# EAGLE schematic BEP32_12nutzen_stencil (EAGLE 6.4), part 2 of 4
## Sheet 5 of 12
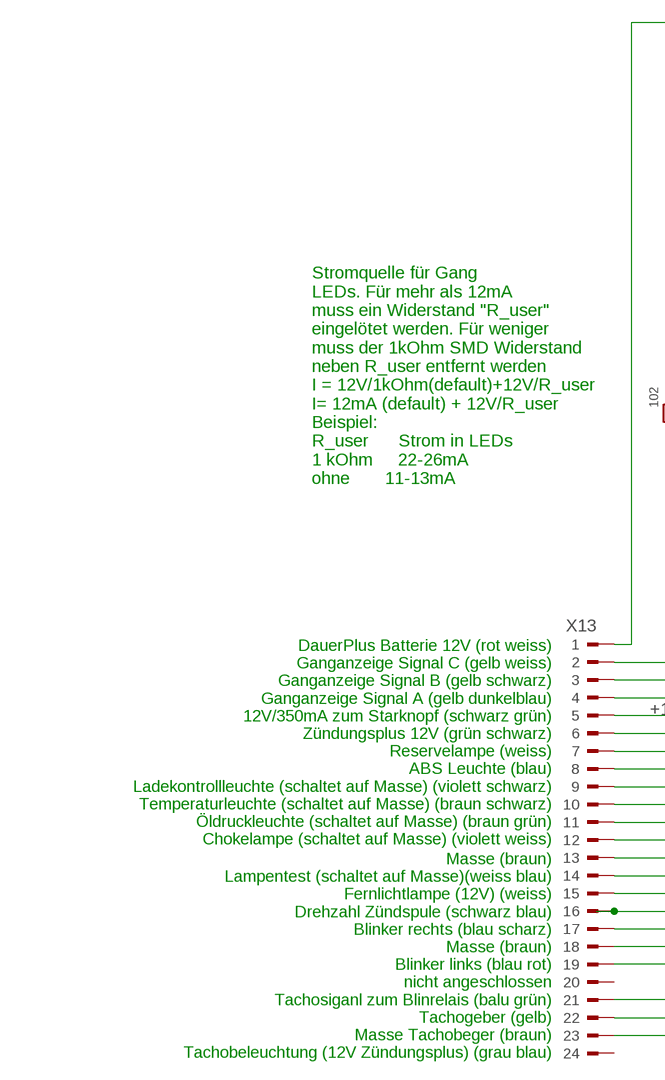
[diagram p8: schematic, sheet 5, part 1 of 2]
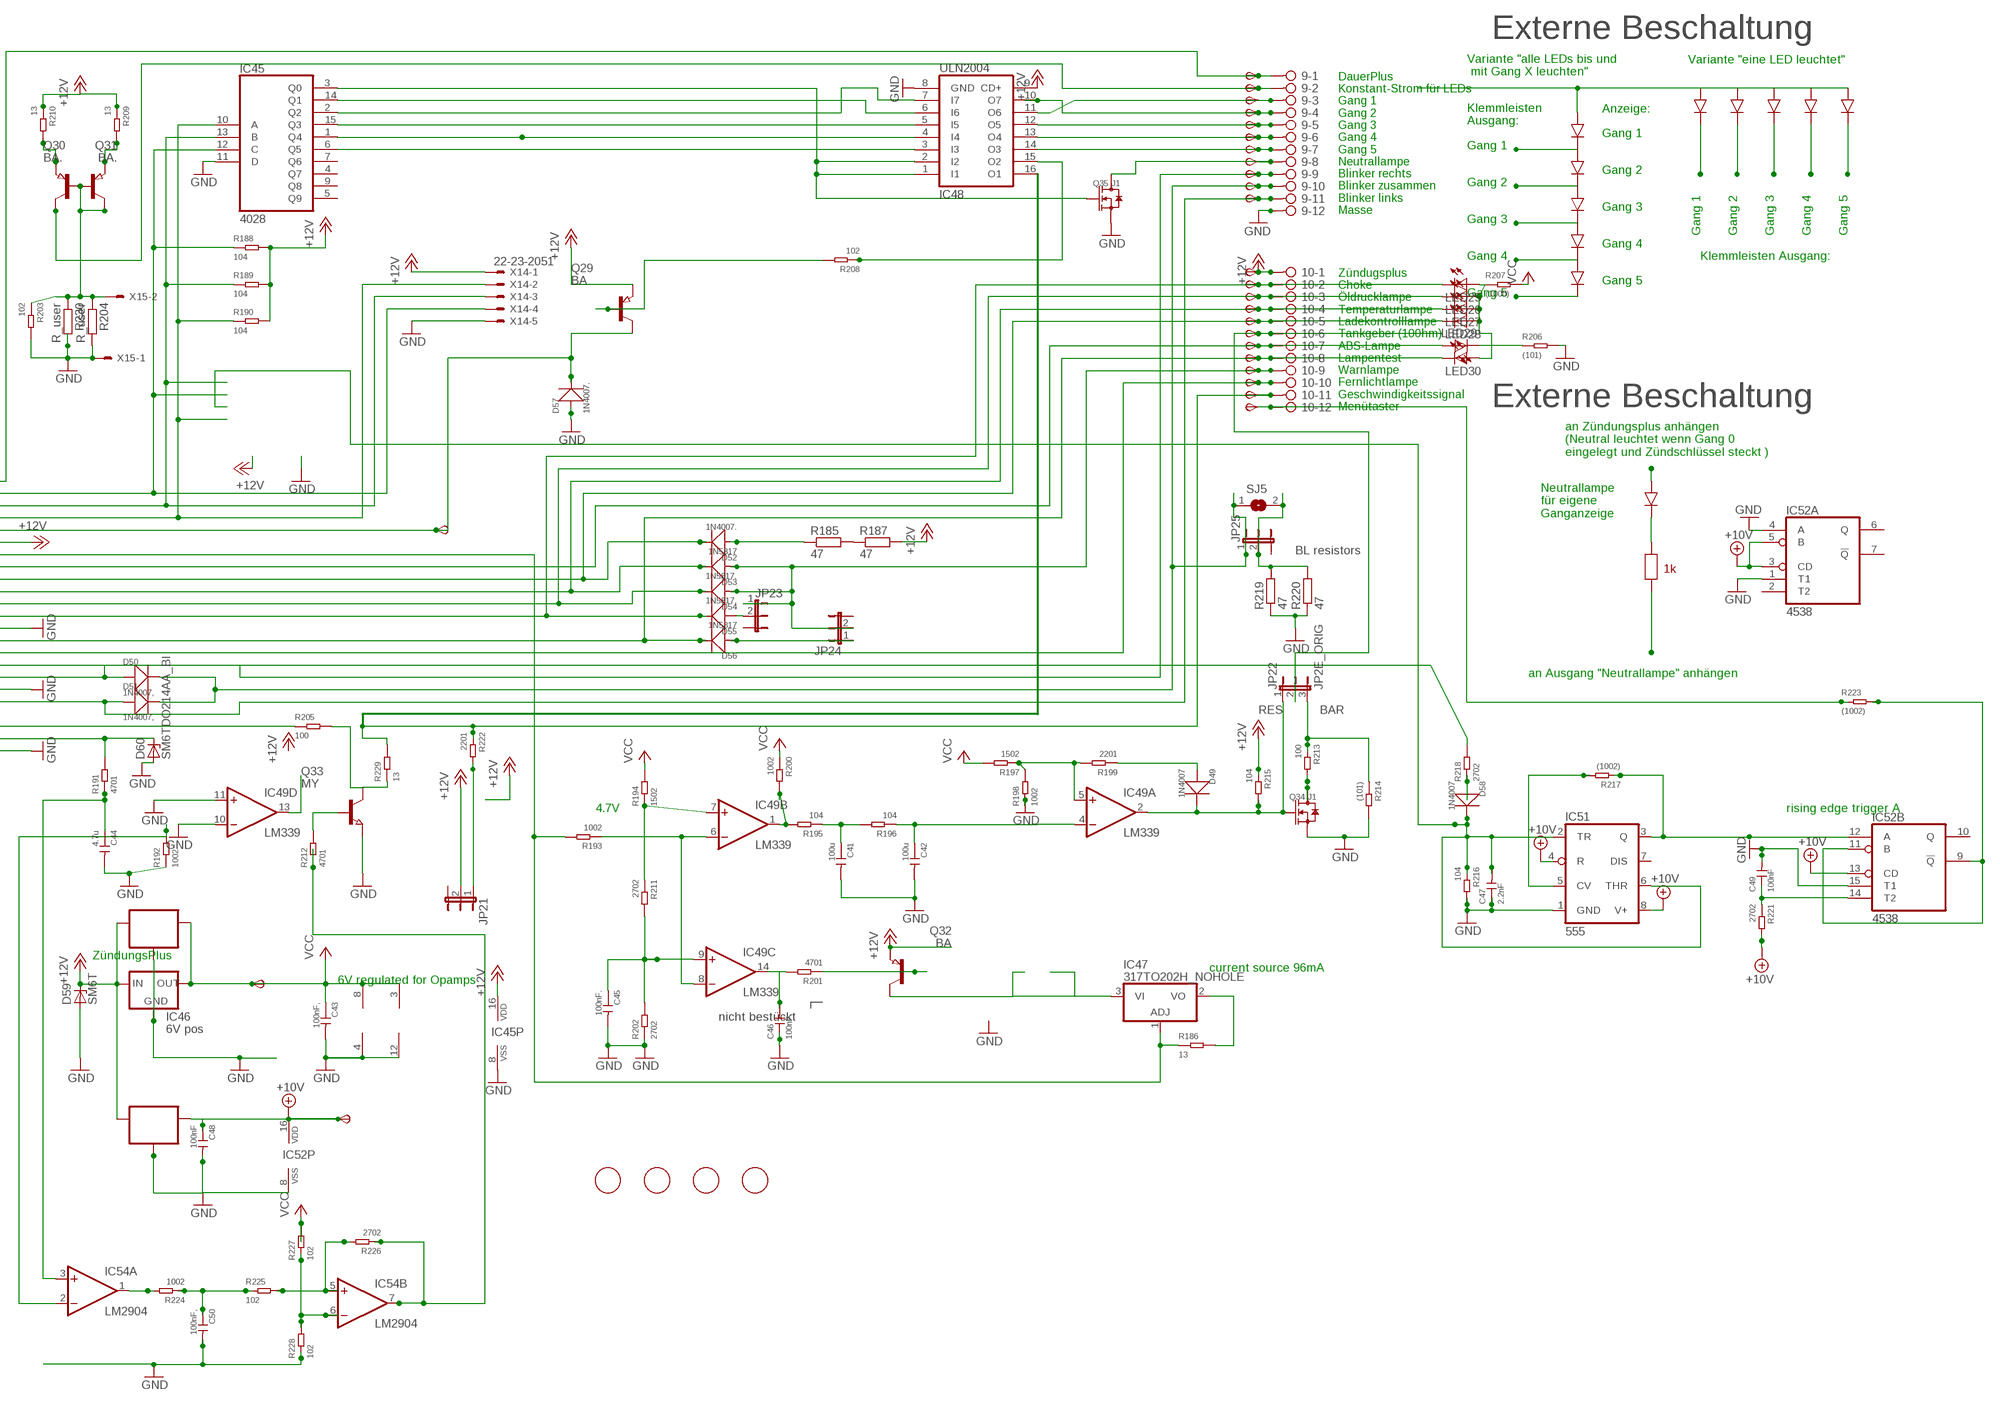
[diagram p9: schematic, sheet 5, part 2 of 2]

### Parts
6V4  TPSB2.0  [B2.0]
9  2081-1132  [12-PIN]
10  2081-1132  [12-PIN]
10V4  TPSB2.0  [B2.0]
C41  100u  CERAMIC-100UF-6.3V-20%-X5R(1206)  [C1206]
C42  100u  CERAMIC-100UF-6.3V-20%-X5R(1206)  [C1206]
C43  100nF,  CERAMIC-100NF-50V-10%-X7R(0805)  [C0805]
C44  4.7u  CERAMIC-4.7UF-25V-10%-X5R(0805)  [C0805]
C45  100nF.  CERAMIC-100NF-50V-10%-X7R(0805)  [C0805]
C46  100nF.  CERAMIC-100NF-50V-10%-X7R(0805)  [C0805]
C47  2.2nF  CERAMIC-100NF-50V-10%-X7R(0805)  [C0805]
C48  100nF  CERAMIC-100NF-50V-10%-X7R(0805)  [C0805]
C49  100nF  CERAMIC-100NF-50V-10%-X7R(0805)  [C0805]
C50  100nF,  CERAMIC-100NF-50V-10%-X7R(0805)  [C0805]
D49  1N4007  DIODE-GEN-PURPOSE-1KV-1A(DO-214AC)  [DO-214AC]
D50  1N4007,  DIODE-GEN-PURPOSE-1KV-1A(DO-214AC)  [DO-214AC]
D51  1N4007,  DIODE-GEN-PURPOSE-1KV-1A(DO-214AC)  [DO-214AC]
D52  1N4007.  DIODE-GEN-PURPOSE-1KV-1A(DO-214AC)  [DO-214AC]
D53  1N5817  DIODE-GEN-PURPOSE-1KV-1A(DO-214AC)DO-214AC/1206  [DO-214AC_SLIM]
D54  1N5817.  DIODE-GEN-PURPOSE-1KV-1A(DO-214AC)DO-214AC/1206  [DO-214AC_SLIM]
D55  1N5817.  DIODE-GEN-PURPOSE-1KV-1A(DO-214AC)DO-214AC/1206  [DO-214AC_SLIM]
D56  1N5817  DIODE-GEN-PURPOSE-1KV-1A(DO-214AC)DO-214AC/1206  [DO-214AC_SLIM]
D57  1N4007.  DIODE-GEN-PURPOSE-1KV-1A(DO-214AC)  [DO-214AC]
D58  1N4007  DIODE-GEN-PURPOSE-1KV-1A(DO-214AC)  [DO-214AC]
D59  SM6T  [DO214AA]
D60  SM6TDO214AA_BI  [DO214AA_BI]
FID17  FIDUCIAL  [FIDUCIAL_1MM]
FID18  FIDUCIAL  [FIDUCIAL_1MM]
FID19  FIDUCIAL  [FIDUCIAL_1MM]
FID20  FIDUCIAL  [FIDUCIAL_1MM]
IC45  4028  4028D  [SO16]
IC46  6V pos  78LXX  [78LXX]
IC47  317TO202H_NOHOLE  [TO220H_NOHOLE]
IC48  ULN2004  ULN2004AD  [SO16]
IC49  LM339  LM339D  [SO14]
IC50  78L06  78LXXSOT89_ROUND  [SOT89_ROUND]
IC51  555  NE555D  [SO08]
IC52  4538  4538D  [SO16]
IC53  78L10  78LXXSOT89_ROUND  [SOT89_ROUND]
IC54  LM2904  LM358D  [SO08]
JP21  JP2EJP2_SMALLPADS  [JP2_SMALLPADS]
JP22  JP2E_ORIG  [JP2_ORIG_SMALLPADS]
JP23  JP2EJP2_SMALLPADS  [JP2_SMALLPADS]
JP24  JP2EJP2_SMALLPADS  [JP2_SMALLPADS]
JP25  JP2EJP2_SMALLPADS  [JP2_SMALLPADS]
LED25  LEDLD260  [LD260]
LED26  LEDLD260  [LD260]
LED27  LEDLD260  [LD260]
LED28  LEDLD260  [LD260]
LED29  LEDLD260  [LD260]
LED30  LEDLD260  [LD260]
Q29  BA  PNP-TRANSISTOR_SOT89  [SOT89]
Q30  BA.  PNP-TRANSISTOR_SOT89  [SOT89]
Q31  BA.  PNP-TRANSISTOR_SOT89  [SOT89]
Q32  BA  PNP-TRANSISTOR_SOT89  [SOT89]
Q33  MY  NPN-TRANSISTOR_SOT89  [SOT89]
Q34  J1  SMD-MOSFET-N-CH-50V-200MA-BSS138W-7-F(SOT-23)  [SOT-23]
Q35  J1  SMD-MOSFET-N-CH-50V-200MA-BSS138W-7-F(SOT-23)  [SOT-23]
R185  47  R-EU_V235/17_1MM  [V235/17_1MM]
R186  13  SMD-RES-13R-5%-1/4W(1206)  [R1206]
R187  47  R-EU_V235/17_1MM  [V235/17_1MM]
R188  104  SMD-RES-10K-1%-1/8W(0805)  [R0805]
R189  104  SMD-RES-10K-1%-1/8W(0805)  [R0805]
R190  104  SMD-RES-10K-1%-1/8W(0805)  [R0805]
R191  4701  SMD-RES-4.7K-5%-1/8W(0805)  [R0805]
R192  1002  SMD-RES-10K-1%-1/8W(0805)  [R0805]
R193  1002  SMD-RES-10K-1%-1/8W(0805)  [R0805]
R194  1502  SMD-RES-10K-1%-1/8W(0805)  [R0805]
R195  104  SMD-RES-10K-1%-1/8W(0805)  [R0805]
R196  104  SMD-RES-10K-1%-1/8W(0805)  [R0805]
R197  1502  SMD-RES-10K-1%-1/8W(0805)  [R0805]
R198  1002  SMD-RES-10K-1%-1/8W(0805)  [R0805]
R199  2201  SMD-RES-2.2K-5%-1/8W(0805)  [R0805]
R200  1002  SMD-RES-10K-1%-1/8W(0805)  [R0805]
R201  4701  SMD-RES-4.7K-5%-1/8W(0805)  [R0805]
R202  2702  SMD-RES-4.7K-5%-1/8W(0805)  [R0805]
R203  102  SMD-RES-1K-5%-1/8W(0805)  [R0805]
R204  R_user  R-EU_R0805  [R0805]
R205  100  SMD-RES-220R-5%-1/8W(0805)  [R0805]
R206  (101)  SMD-RES-100R-5%-1/8W(0805)  [R0805]
R207  (1000)  SMD-RES-100R-5%-1/8W(0805)  [R0805]
R208  102  SMD-RES-1K-5%-1/8W(0805)  [R0805]
R209  13  SMD-RES-13R-5%-1/4W(1206)  [R1206]
R210  13  SMD-RES-13R-5%-1/4W(1206)  [R1206]
R211  2702  SMD-RES-4.7K-5%-1/8W(0805)  [R0805]
R212  4701  SMD-RES-4.7K-5%-1/8W(0805)  [R0805]
R213  100  SMD-RES-2.2K-5%-1/8W(0805)  [R0805]
R214  (101)  SMD-RES-2.2K-5%-1/8W(0805)  [R0805]
R215  104  SMD-RES-10K-1%-1/8W(0805)  [R0805]
R216  104  SMD-RES-10K-1%-1/8W(0805)  [R0805]
R217  (1002)  SMD-RES-10K-1%-1/8W(0805)  [R0805]
R218  2702  SMD-RES-10K-1%-1/8W(0805)  [R0805]
R219  47  R-EU_V235/17_1MM  [V235/17_1MM]
R220  47  R-EU_V235/17_1MM  [V235/17_1MM]
R221  2702  SMD-RES-4.7K-5%-1/8W(0805)  [R0805]
R222  2201  SMD-RES-2.2K-5%-1/8W(0805)  [R0805]
R223  (1002)  SMD-RES-4.7K-5%-1/8W(0805)  [R0805]
R224  1002  SMD-RES-10K-1%-1/8W(0805)  [R0805]
R225  102  SMD-RES-1K-5%-1/8W(0805)  [R0805]
R226  2702  SMD-RES-4.7K-5%-1/8W(0805)  [R0805]
R227  102  SMD-RES-1K-5%-1/8W(0805)  [R0805]
R228  102  SMD-RES-1K-5%-1/8W(0805)  [R0805]
R229  13  SMD-RES-13R-5%-1/4W(1206)  [R1206]
R230  R_user  R-EU_R0805  [R0805]
SJ5  SJ  [SJ]
START4  TPSB2.0  [B2.0]
TP93  TPSB2.0  [B2.0]
TP94  TPSB2.0  [B2.0]
TP95  TPSB2.0  [B2.0]
TP96  TPSB2.0  [B2.0]
TP97  TPSB2.0  [B2.0]
TP98  TPSB2.0  [B2.0]
TP99  TPSB2.0  [B2.0]
TP100  TPSB2.0  [B2.0]
TP101  TPSB2.0  [B2.0]
TP102  TPSB2.0  [B2.0]
TP103  TPSB2.0  [B2.0]
TP104  TPSB2.0  [B2.0]
TP105  TPSB2.0  [B2.0]
TP106  TPSB2.0  [B2.0]
TP107  TPSB2.0  [B2.0]
TP108  TPSB2.0  [B2.0]
TP109  TPSB2.0  [B2.0]
TP110  TPSB2.0  [B2.0]
TP111  TPSB1,27  [B1,27]
TP112  TPSB2.0  [B2.0]
TP113  TPSB2.0  [B2.0]
TP114  TPSB2.0  [B2.0]
TP115  TPSB2.0  [B2.0]
X13  CON_BMWV2  [24-PIN_V2]
X14  22-23-2051  [22-23-2051]
X15  22-23-2021  [22-23-2021]

### Nets
+10V: 10V4.TP(PP) C48.1 IC51.4(R) IC51.8(V+) IC52.3(A:CD) IC52.5(A:B) IC52.13(B:CD) IC52.16(P:VDD) IC53.1(OUT) R221.2 ; also sheet 1,2,3,4,6,7,8,9,10,11,12
+12V: 10.1 D59.C IC45.16(VDD) IC46.IN IC48.9(CD+) IC50.3(IN) IC53.3(IN) JP21.2 Q29.3(E) Q32.3(E) R187.2 R188.2 R189.2 R190.2 R209.1 R210.1 R215.1 TP114.TP(PP) X13.6 X14.1 ; also sheet 1,2,3,4,6,7,8,9,10,11,12
+12V5: IC54.7(B:OUT) R212.1 R226.1
GND: 9.12 C41.2 C42.2 C43.2 C44.2 C45.2 C46.1 C47.1 C48.2 C49.2 C50.2 D57.1(+) D59.A D60.A IC45.8(VSS) IC45.11(D) IC46.GND IC48.8(GND) IC49.10(D:-IN) IC49.11(D:+IN) IC49.12(P:GND) IC50.2(GND) IC50.2@1(GND) IC51.1(GND) IC52.1(A:T1) IC52.4(A:A) IC52.8(P:VSS) IC52.15(B:T1) IC53.2(GND) IC53.2@1(GND) IC54.4(P:V-) Q33.3(E) Q34.2(S) Q35.2(S) R192.1 R198.1 R202.1 R203.2 R204.2 R206.2 R214.2 R216.2 R219.1 R220.1 R228.1 R230.2 X13.13 X13.18 X13.23 X14.5 X15.1 ; also sheet 1,2,3,4,6,7,8,9,10,11,12
N$389: R185.2 R187.1
N$390: 10.9 D53.1(+) D54.1(+) JP23.1 JP24.2 TP111.TP(PP)
N$391: IC45.10(A) R190.1 X13.4 X14.2
N$392: IC45.13(B) R189.1 X13.3 X14.3
N$393: D57.2(-) Q29.2(C) START4.TP(PP) X13.5
N$394: IC45.12(C) R188.1 X13.2 X14.4
N$395: 10.7 LED29.A TP109.TP(PP) X13.8
N$396: 10.2 D55.2(-) LED25.K(C) TP104.TP(PP) X13.12
N$397: 10.3 D54.2(-) LED26.K(C) TP105.TP(PP) X13.11
N$398: 10.4 D53.2(-) LED27.K(C) TP106.TP(PP) X13.10
N$399: 10.8 D56.2(-) LED30.K(C) TP110.TP(PP) X13.14
N$400: 9.9 D50.1(+) TP101.TP(PP) X13.17
N$401: 9.11 D51.1(+) TP103.TP(PP) X13.19
N$402: D60.C R191.2 X13.22
N$403: C44.1 IC54.3(A:+IN) R191.1
N$404: 10.11 IC48.16(O1) R222.1 R229.2 TP113.TP(PP)
N$405: IC49.1(B:OUT) R195.2 R200.2
N$406: C41.1 R195.1 R196.2
N$407: C42.1 IC49.4(A:-IN) R196.1
N$408: IC49.5(A:+IN) R197.1 R198.2 R199.2
N$409: D49.1(+) R199.1
N$410: C45.1 IC49.9(C:+IN) R202.2 R211.2
N$411: C46.2 IC49.14(C:OUT) R201.2
N$412: Q32.1(B) R201.1
N$413: IC45.2(Q2) IC48.7(I7)
N$414: 9.5 IC48.12(O5) TP97.TP(PP)
N$415: IC45.1(Q4) IC48.4(I4)
N$416: 9.8 Q35.3(D) TP100.TP(PP)
N$417: 10.10 TP112.TP(PP) X13.15
N$418: 10.5 D52.2(-) LED28.K(C) TP107.TP(PP) X13.9
N$419: D52.1(+) R185.1
N$420: IC45.6(Q5) IC48.3(I3)
N$421: 9.4 IC48.10(O7) TP96.TP(PP)
N$422: IC47.1(ADJ) R186.1 R193.2 X13.7
N$423: IC49.6(B:-IN) IC49.8(C:-IN) R193.1
N$424: 9.2 Q31.2(C) TP94.TP(PP)
N$425: 9.1 TP93.TP(PP) X13.1
N$439: R218.2 X13.16
N$440: IC45.15(Q3) IC48.5(I5)
N$441: 9.6 IC48.13(O4) TP98.TP(PP)
N$442: 9.7 IC48.14(O3) TP99.TP(PP)
N$443: 10.6 JP22.2 TP108.TP(PP)
N$444: LED29.K(C) R206.1
N$445: LED25.A LED26.A LED27.A LED28.A LED30.A R207.1
N$446: Q29.1(B) R208.2
N$447: IC45.3(Q0) IC48.1(I1) IC48.2(I2) Q35.1(G)
N$448: IC45.14(Q1) IC48.6(I6)
N$449: 9.3 IC48.11(O6) TP95.TP(PP)
N$450: Q30.1(B) Q30.2(C) Q31.1(B) R203.1 R204.1 R230.1 X15.2
N$451: Q31.3(E) R210.2
N$452: Q30.3(E) R209.2
N$453: IC49.7(B:+IN) R194.1 R211.1
N$454: IC54.2(A:-IN) R192.2
N$455: Q33.1(B) R212.2
N$456: Q34.3(D) R213.2
N$457: IC47.2(VO) R186.2
N$458: IC47.3(VI) Q32.2(C)
N$459: C47.2 D58.2(-) IC51.2(TR) IC51.6(THR) R216.1
N$460: IC51.5(CV) R217.2
N$461: IC51.3(Q) IC52.12(B:A) R217.1
N$462: D58.1(+) R218.1
N$463: 9.10 D50.2(-) D51.2(-) JP25.1 SJ5.1 TP102.TP(PP)
N$464: JP25.2 R219.2 R220.2 SJ5.2
N$465: IC52.9(B:!Q) IC52.11(B:B) R223.2
N$466: C49.1 IC52.14(B:T2) R221.1
N$467: JP21.1 R222.2
N$468: IC48.15(O2) R208.1
N$469: 10.12 R223.1 TP115.TP(PP)
N$470: D55.1(+) JP23.2
N$471: D49.2(-) IC49.2(A:OUT) JP22.1 Q34.1(G) R215.2
N$472: IC54.1(A:OUT) R224.2
N$473: C50.1 R224.1 R225.1
N$474: IC54.5(B:+IN) R225.2 R226.2
N$475: IC54.6(B:-IN) R227.1 R228.2
N$476: D56.1(+) JP24.1
N$477: JP22.3 R213.1 R214.1
N$478: IC49.13(D:OUT)
N$479: R205.1 X13.21
N$480: Q33.2(C) R205.2 R229.1
VCC: 6V4.TP(PP) C43.1 IC46.OUT IC49.3(P:V+) IC50.1(OUT) IC54.8(P:V+) R194.2 R197.2 R200.1 R207.2 R227.2 ; also sheet 1,2,3,4,6,7,8,9,10,11,12
Unconnected: IC45.4(Q7) IC45.5(Q9) IC45.7(Q6) IC45.9(Q8) IC51.7(DIS) IC52.2(A:T2) IC52.6(A:Q) IC52.7(A:!Q) IC52.10(B:Q) X13.20 X13.24

### Notes on the sheet
- Externe Beschaltung
- Variante "eine LED leuchtet"
- Variante "alle LEDs bis und
   mit Gang X leuchten"
- Anzeige:
- Klemmleisten
  Ausgang:
- Gang 1
- DauerPlus
  Konstant-Strom für LEDs
  Gang 1
  Gang 2
  Gang 3
  Gang 4
  Gang 5
  Neutrallampe
  Blinker rechts
  Blinker zusammen
  Blinker links
  Masse
- Gang 1
- Gang 2
- Gang 2
- Gang 3
- Gang 3
- Gang 1 | Gang 2 | Gang 3 | Gang 4 | Gang 5
- Gang 4
- Gang 4 | Klemmleisten Ausgang:
- Gang 5
- Gang 5
- Zündugsplus
  Choke
  Öldrucklampe
  Temperaturlampe
  Ladekontrolllampe
  Tankgeber (100hm)
  ABS-Lampe
  Lampentest
  Warnlampe
  Fernlichtlampe
  Geschwindigkeitssignal
  Menütaster
- Stromquelle für Gang
  LEDs. Für mehr als 12mA
  muss ein Widerstand "R_user"
  eingelötet werden. Für weniger
  muss der 1kOhm SMD Widerstand
  neben R_user entfernt werden
  I = 12V/1kOhm(default)+12V/R_user
  I= 12mA (default) + 12V/R_user
  Beispiel:
  R_user      Strom in LEDs
  1 kOhm     22-26mA
  ohne       11-13mA
- Externe Beschaltung
- an Zündungsplus anhängen
  (Neutral leuchtet wenn Gang 0
  eingelegt und Zündschlüssel steckt )
- Neutrallampe
  für eigene
  Ganganzeige
- DauerPlus Batterie 12V (rot weiss)
  Ganganzeige Signal C (gelb weiss)
  Ganganzeige Signal B (gelb schwarz)
  Ganganzeige Signal A (gelb dunkelblau)
  12V/350mA zum Starknopf (schwarz grün)
  Zündungsplus 12V (grün schwarz)
  Reservelampe (weiss)
  ABS Leuchte (blau)
  Ladekontrollleuchte (schaltet auf Masse) (violett schwarz)
  Temperaturleuchte (schaltet auf Masse) (braun schwarz)
  Öldruckleuchte (schaltet auf Masse) (braun grün)
  Chokelampe (schaltet auf Masse) (violett weiss)
- BL resistors
- 1k
- an Ausgang "Neutrallampe" anhängen
- Masse (braun)
  Lampentest (schaltet auf Masse)(weiss blau)
  Fernlichtlampe (12V) (weiss)
  Drehzahl Zündspule (schwarz blau)
  Blinker rechts (blau scharz)
  Masse (braun)
  Blinker links (blau rot)
  nicht angeschlossen
  Tachosiganl zum Blinrelais (balu grün)
  Tachogeber (gelb)
  Masse Tachobeger (braun)
  Tachobeleuchtung (12V Zündungsplus) (grau blau)
- RES | BAR
- 4.7V | rising edge trigger A
- ZündungsPlus
- current source 96mA
- 6V regulated for Opamps
- nicht bestückt

## Sheet 6 of 12
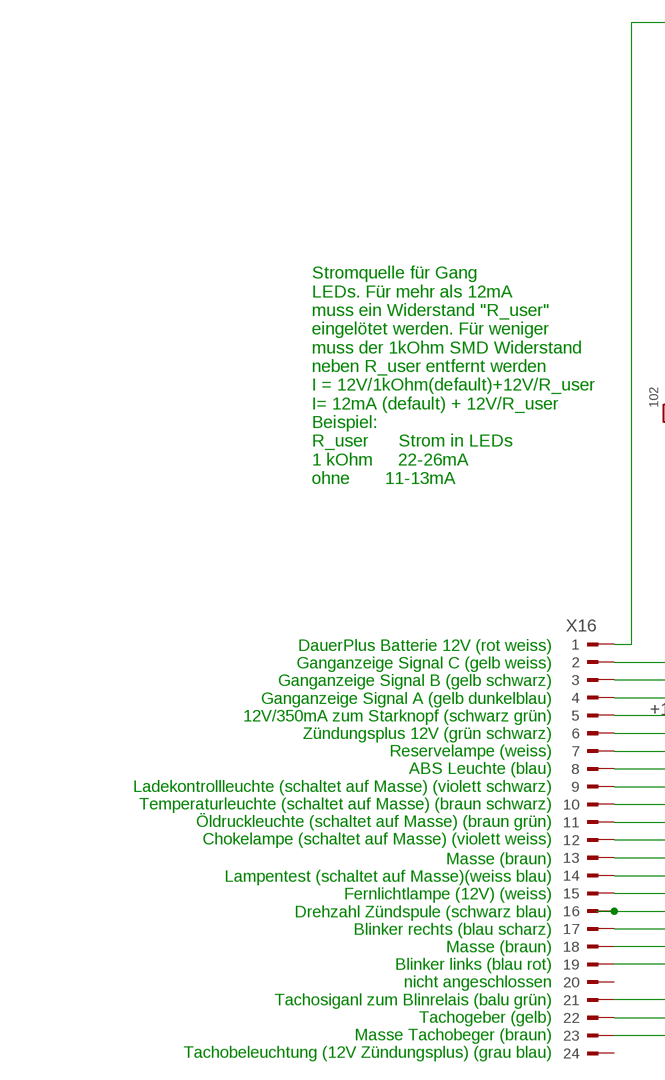
[diagram p10: schematic, sheet 6, part 1 of 2]
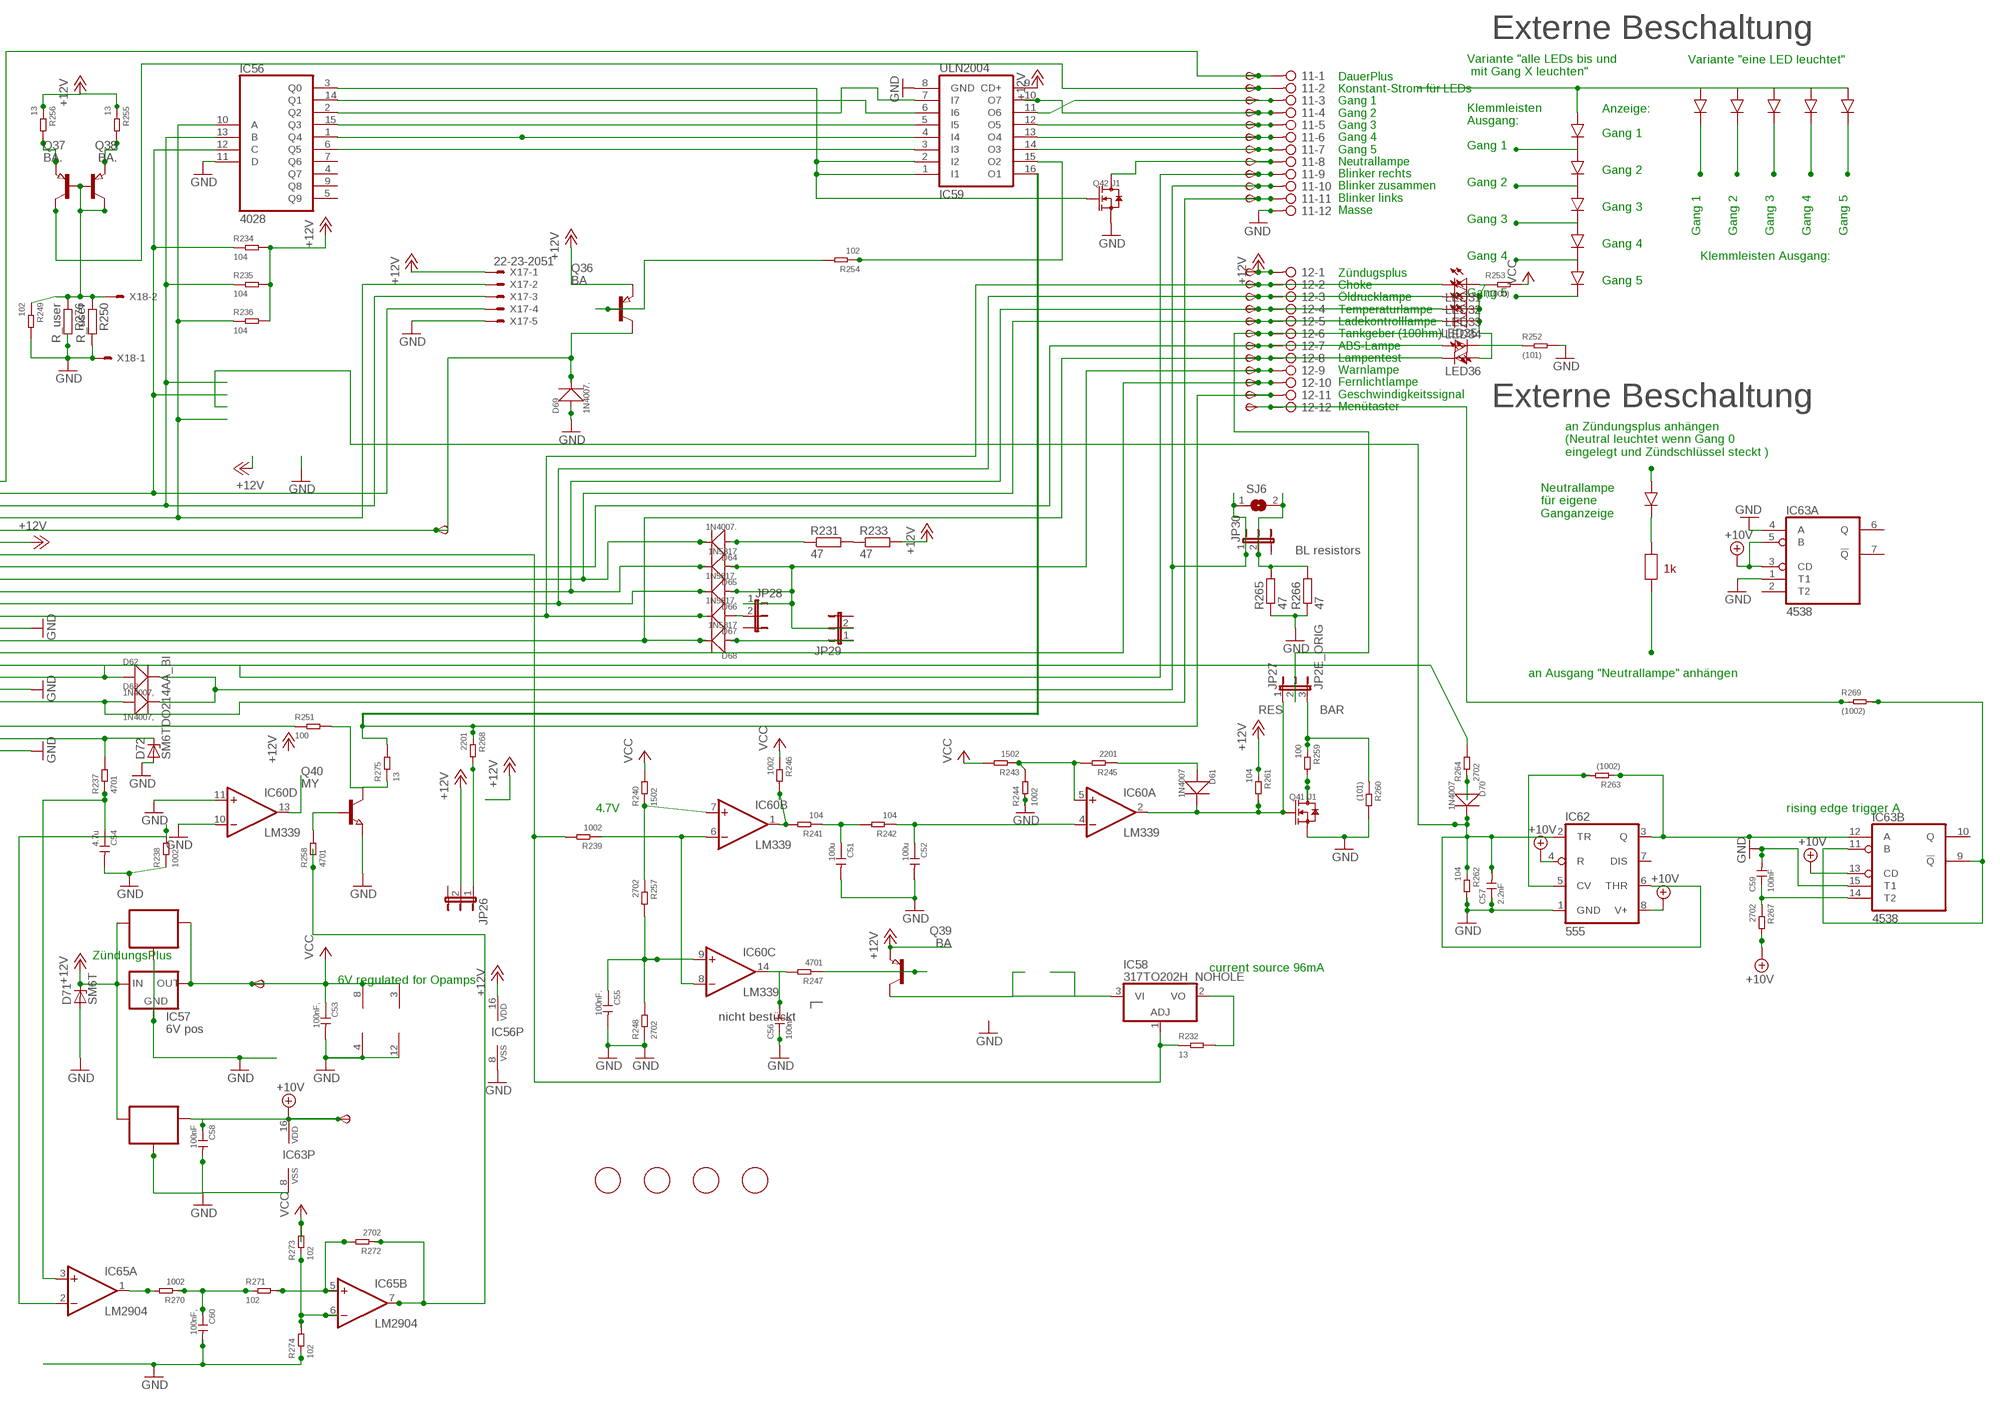
[diagram p11: schematic, sheet 6, part 2 of 2]

### Parts
6V5  TPSB2.0  [B2.0]
10V5  TPSB2.0  [B2.0]
11  2081-1132  [12-PIN]
12  2081-1132  [12-PIN]
C51  100u  CERAMIC-100UF-6.3V-20%-X5R(1206)  [C1206]
C52  100u  CERAMIC-100UF-6.3V-20%-X5R(1206)  [C1206]
C53  100nF,  CERAMIC-100NF-50V-10%-X7R(0805)  [C0805]
C54  4.7u  CERAMIC-4.7UF-25V-10%-X5R(0805)  [C0805]
C55  100nF.  CERAMIC-100NF-50V-10%-X7R(0805)  [C0805]
C56  100nF.  CERAMIC-100NF-50V-10%-X7R(0805)  [C0805]
C57  2.2nF  CERAMIC-100NF-50V-10%-X7R(0805)  [C0805]
C58  100nF  CERAMIC-100NF-50V-10%-X7R(0805)  [C0805]
C59  100nF  CERAMIC-100NF-50V-10%-X7R(0805)  [C0805]
C60  100nF,  CERAMIC-100NF-50V-10%-X7R(0805)  [C0805]
D61  1N4007  DIODE-GEN-PURPOSE-1KV-1A(DO-214AC)  [DO-214AC]
D62  1N4007,  DIODE-GEN-PURPOSE-1KV-1A(DO-214AC)  [DO-214AC]
D63  1N4007,  DIODE-GEN-PURPOSE-1KV-1A(DO-214AC)  [DO-214AC]
D64  1N4007.  DIODE-GEN-PURPOSE-1KV-1A(DO-214AC)  [DO-214AC]
D65  1N5817  DIODE-GEN-PURPOSE-1KV-1A(DO-214AC)DO-214AC/1206  [DO-214AC_SLIM]
D66  1N5817.  DIODE-GEN-PURPOSE-1KV-1A(DO-214AC)DO-214AC/1206  [DO-214AC_SLIM]
D67  1N5817.  DIODE-GEN-PURPOSE-1KV-1A(DO-214AC)DO-214AC/1206  [DO-214AC_SLIM]
D68  1N5817  DIODE-GEN-PURPOSE-1KV-1A(DO-214AC)DO-214AC/1206  [DO-214AC_SLIM]
D69  1N4007.  DIODE-GEN-PURPOSE-1KV-1A(DO-214AC)  [DO-214AC]
D70  1N4007  DIODE-GEN-PURPOSE-1KV-1A(DO-214AC)  [DO-214AC]
D71  SM6T  [DO214AA]
D72  SM6TDO214AA_BI  [DO214AA_BI]
FID21  FIDUCIAL  [FIDUCIAL_1MM]
FID22  FIDUCIAL  [FIDUCIAL_1MM]
FID23  FIDUCIAL  [FIDUCIAL_1MM]
FID24  FIDUCIAL  [FIDUCIAL_1MM]
IC56  4028  4028D  [SO16]
IC57  6V pos  78LXX  [78LXX]
IC58  317TO202H_NOHOLE  [TO220H_NOHOLE]
IC59  ULN2004  ULN2004AD  [SO16]
IC60  LM339  LM339D  [SO14]
IC61  78L06  78LXXSOT89_ROUND  [SOT89_ROUND]
IC62  555  NE555D  [SO08]
IC63  4538  4538D  [SO16]
IC64  78L10  78LXXSOT89_ROUND  [SOT89_ROUND]
IC65  LM2904  LM358D  [SO08]
JP26  JP2EJP2_SMALLPADS  [JP2_SMALLPADS]
JP27  JP2E_ORIG  [JP2_ORIG_SMALLPADS]
JP28  JP2EJP2_SMALLPADS  [JP2_SMALLPADS]
JP29  JP2EJP2_SMALLPADS  [JP2_SMALLPADS]
JP30  JP2EJP2_SMALLPADS  [JP2_SMALLPADS]
LED31  LEDLD260  [LD260]
LED32  LEDLD260  [LD260]
LED33  LEDLD260  [LD260]
LED34  LEDLD260  [LD260]
LED35  LEDLD260  [LD260]
LED36  LEDLD260  [LD260]
Q36  BA  PNP-TRANSISTOR_SOT89  [SOT89]
Q37  BA.  PNP-TRANSISTOR_SOT89  [SOT89]
Q38  BA.  PNP-TRANSISTOR_SOT89  [SOT89]
Q39  BA  PNP-TRANSISTOR_SOT89  [SOT89]
Q40  MY  NPN-TRANSISTOR_SOT89  [SOT89]
Q41  J1  SMD-MOSFET-N-CH-50V-200MA-BSS138W-7-F(SOT-23)  [SOT-23]
Q42  J1  SMD-MOSFET-N-CH-50V-200MA-BSS138W-7-F(SOT-23)  [SOT-23]
R231  47  R-EU_V235/17_1MM  [V235/17_1MM]
R232  13  SMD-RES-13R-5%-1/4W(1206)  [R1206]
R233  47  R-EU_V235/17_1MM  [V235/17_1MM]
R234  104  SMD-RES-10K-1%-1/8W(0805)  [R0805]
R235  104  SMD-RES-10K-1%-1/8W(0805)  [R0805]
R236  104  SMD-RES-10K-1%-1/8W(0805)  [R0805]
R237  4701  SMD-RES-4.7K-5%-1/8W(0805)  [R0805]
R238  1002  SMD-RES-10K-1%-1/8W(0805)  [R0805]
R239  1002  SMD-RES-10K-1%-1/8W(0805)  [R0805]
R240  1502  SMD-RES-10K-1%-1/8W(0805)  [R0805]
R241  104  SMD-RES-10K-1%-1/8W(0805)  [R0805]
R242  104  SMD-RES-10K-1%-1/8W(0805)  [R0805]
R243  1502  SMD-RES-10K-1%-1/8W(0805)  [R0805]
R244  1002  SMD-RES-10K-1%-1/8W(0805)  [R0805]
R245  2201  SMD-RES-2.2K-5%-1/8W(0805)  [R0805]
R246  1002  SMD-RES-10K-1%-1/8W(0805)  [R0805]
R247  4701  SMD-RES-4.7K-5%-1/8W(0805)  [R0805]
R248  2702  SMD-RES-4.7K-5%-1/8W(0805)  [R0805]
R249  102  SMD-RES-1K-5%-1/8W(0805)  [R0805]
R250  R_user  R-EU_R0805  [R0805]
R251  100  SMD-RES-220R-5%-1/8W(0805)  [R0805]
R252  (101)  SMD-RES-100R-5%-1/8W(0805)  [R0805]
R253  (1000)  SMD-RES-100R-5%-1/8W(0805)  [R0805]
R254  102  SMD-RES-1K-5%-1/8W(0805)  [R0805]
R255  13  SMD-RES-13R-5%-1/4W(1206)  [R1206]
R256  13  SMD-RES-13R-5%-1/4W(1206)  [R1206]
R257  2702  SMD-RES-4.7K-5%-1/8W(0805)  [R0805]
R258  4701  SMD-RES-4.7K-5%-1/8W(0805)  [R0805]
R259  100  SMD-RES-2.2K-5%-1/8W(0805)  [R0805]
R260  (101)  SMD-RES-2.2K-5%-1/8W(0805)  [R0805]
R261  104  SMD-RES-10K-1%-1/8W(0805)  [R0805]
R262  104  SMD-RES-10K-1%-1/8W(0805)  [R0805]
R263  (1002)  SMD-RES-10K-1%-1/8W(0805)  [R0805]
R264  2702  SMD-RES-10K-1%-1/8W(0805)  [R0805]
R265  47  R-EU_V235/17_1MM  [V235/17_1MM]
R266  47  R-EU_V235/17_1MM  [V235/17_1MM]
R267  2702  SMD-RES-4.7K-5%-1/8W(0805)  [R0805]
R268  2201  SMD-RES-2.2K-5%-1/8W(0805)  [R0805]
R269  (1002)  SMD-RES-4.7K-5%-1/8W(0805)  [R0805]
R270  1002  SMD-RES-10K-1%-1/8W(0805)  [R0805]
R271  102  SMD-RES-1K-5%-1/8W(0805)  [R0805]
R272  2702  SMD-RES-4.7K-5%-1/8W(0805)  [R0805]
R273  102  SMD-RES-1K-5%-1/8W(0805)  [R0805]
R274  102  SMD-RES-1K-5%-1/8W(0805)  [R0805]
R275  13  SMD-RES-13R-5%-1/4W(1206)  [R1206]
R276  R_user  R-EU_R0805  [R0805]
SJ6  SJ  [SJ]
START5  TPSB2.0  [B2.0]
TP116  TPSB2.0  [B2.0]
TP117  TPSB2.0  [B2.0]
TP118  TPSB2.0  [B2.0]
TP119  TPSB2.0  [B2.0]
TP120  TPSB2.0  [B2.0]
TP121  TPSB2.0  [B2.0]
TP122  TPSB2.0  [B2.0]
TP123  TPSB2.0  [B2.0]
TP124  TPSB2.0  [B2.0]
TP125  TPSB2.0  [B2.0]
TP126  TPSB2.0  [B2.0]
TP127  TPSB2.0  [B2.0]
TP128  TPSB2.0  [B2.0]
TP129  TPSB2.0  [B2.0]
TP130  TPSB2.0  [B2.0]
TP131  TPSB2.0  [B2.0]
TP132  TPSB2.0  [B2.0]
TP133  TPSB2.0  [B2.0]
TP134  TPSB1,27  [B1,27]
TP135  TPSB2.0  [B2.0]
TP136  TPSB2.0  [B2.0]
TP137  TPSB2.0  [B2.0]
TP138  TPSB2.0  [B2.0]
X16  CON_BMWV2  [24-PIN_V2]
X17  22-23-2051  [22-23-2051]
X18  22-23-2021  [22-23-2021]

### Nets
+10V: 10V5.TP(PP) C58.1 IC62.4(R) IC62.8(V+) IC63.3(A:CD) IC63.5(A:B) IC63.13(B:CD) IC63.16(P:VDD) IC64.1(OUT) R267.2 ; also sheet 1,2,3,4,5,7,8,9,10,11,12
+12V: 12.1 D71.C IC56.16(VDD) IC57.IN IC59.9(CD+) IC61.3(IN) IC64.3(IN) JP26.2 Q36.3(E) Q39.3(E) R233.2 R234.2 R235.2 R236.2 R255.1 R256.1 R261.1 TP137.TP(PP) X16.6 X17.1 ; also sheet 1,2,3,4,5,7,8,9,10,11,12
+12V6: IC65.7(B:OUT) R258.1 R272.1
GND: 11.12 C51.2 C52.2 C53.2 C54.2 C55.2 C56.1 C57.1 C58.2 C59.2 C60.2 D69.1(+) D71.A D72.A IC56.8(VSS) IC56.11(D) IC57.GND IC59.8(GND) IC60.10(D:-IN) IC60.11(D:+IN) IC60.12(P:GND) IC61.2(GND) IC61.2@1(GND) IC62.1(GND) IC63.1(A:T1) IC63.4(A:A) IC63.8(P:VSS) IC63.15(B:T1) IC64.2(GND) IC64.2@1(GND) IC65.4(P:V-) Q40.3(E) Q41.2(S) Q42.2(S) R238.1 R244.1 R248.1 R249.2 R250.2 R252.2 R260.2 R262.2 R265.1 R266.1 R274.1 R276.2 X16.13 X16.18 X16.23 X17.5 X18.1 ; also sheet 1,2,3,4,5,7,8,9,10,11,12
N$481: R231.2 R233.1
N$482: 12.9 D65.1(+) D66.1(+) JP28.1 JP29.2 TP134.TP(PP)
N$483: IC56.10(A) R236.1 X16.4 X17.2
N$484: IC56.13(B) R235.1 X16.3 X17.3
N$485: D69.2(-) Q36.2(C) START5.TP(PP) X16.5
N$486: IC56.12(C) R234.1 X16.2 X17.4
N$487: 12.7 LED35.A TP132.TP(PP) X16.8
N$488: 12.2 D67.2(-) LED31.K(C) TP127.TP(PP) X16.12
N$489: 12.3 D66.2(-) LED32.K(C) TP128.TP(PP) X16.11
N$490: 12.4 D65.2(-) LED33.K(C) TP129.TP(PP) X16.10
N$491: 12.8 D68.2(-) LED36.K(C) TP133.TP(PP) X16.14
N$492: 11.9 D62.1(+) TP124.TP(PP) X16.17
N$493: 11.11 D63.1(+) TP126.TP(PP) X16.19
N$494: D72.C R237.2 X16.22
N$495: C54.1 IC65.3(A:+IN) R237.1
N$496: 12.11 IC59.16(O1) R268.1 R275.2 TP136.TP(PP)
N$497: IC60.1(B:OUT) R241.2 R246.2
N$498: C51.1 R241.1 R242.2
N$499: C52.1 IC60.4(A:-IN) R242.1
N$500: IC60.5(A:+IN) R243.1 R244.2 R245.2
N$501: D61.1(+) R245.1
N$502: C55.1 IC60.9(C:+IN) R248.2 R257.2
N$503: C56.2 IC60.14(C:OUT) R247.2
N$504: Q39.1(B) R247.1
N$505: IC56.2(Q2) IC59.7(I7)
N$506: 11.5 IC59.12(O5) TP120.TP(PP)
N$507: IC56.1(Q4) IC59.4(I4)
N$508: 11.8 Q42.3(D) TP123.TP(PP)
N$509: 12.10 TP135.TP(PP) X16.15
N$510: 12.5 D64.2(-) LED34.K(C) TP130.TP(PP) X16.9
N$511: D64.1(+) R231.1
N$512: IC56.6(Q5) IC59.3(I3)
N$513: 11.4 IC59.10(O7) TP119.TP(PP)
N$514: IC58.1(ADJ) R232.1 R239.2 X16.7
N$515: IC60.6(B:-IN) IC60.8(C:-IN) R239.1
N$516: 11.2 Q38.2(C) TP117.TP(PP)
N$517: 11.1 TP116.TP(PP) X16.1
N$531: R264.2 X16.16
N$532: IC56.15(Q3) IC59.5(I5)
N$533: 11.6 IC59.13(O4) TP121.TP(PP)
N$534: 11.7 IC59.14(O3) TP122.TP(PP)
N$535: 12.6 JP27.2 TP131.TP(PP)
N$536: LED35.K(C) R252.1
N$537: LED31.A LED32.A LED33.A LED34.A LED36.A R253.1
N$538: Q36.1(B) R254.2
N$539: IC56.3(Q0) IC59.1(I1) IC59.2(I2) Q42.1(G)
N$540: IC56.14(Q1) IC59.6(I6)
N$541: 11.3 IC59.11(O6) TP118.TP(PP)
N$542: Q37.1(B) Q37.2(C) Q38.1(B) R249.1 R250.1 R276.1 X18.2
N$543: Q38.3(E) R256.2
N$544: Q37.3(E) R255.2
N$545: IC60.7(B:+IN) R240.1 R257.1
N$546: IC65.2(A:-IN) R238.2
N$547: Q40.1(B) R258.2
N$548: Q41.3(D) R259.2
N$549: IC58.2(VO) R232.2
N$550: IC58.3(VI) Q39.2(C)
N$551: C57.2 D70.2(-) IC62.2(TR) IC62.6(THR) R262.1
N$552: IC62.5(CV) R263.2
N$553: IC62.3(Q) IC63.12(B:A) R263.1
N$554: D70.1(+) R264.1
N$555: 11.10 D62.2(-) D63.2(-) JP30.1 SJ6.1 TP125.TP(PP)
N$556: JP30.2 R265.2 R266.2 SJ6.2
N$557: IC63.9(B:!Q) IC63.11(B:B) R269.2
N$558: C59.1 IC63.14(B:T2) R267.1
N$559: JP26.1 R268.2
N$560: IC59.15(O2) R254.1
N$561: 12.12 R269.1 TP138.TP(PP)
N$562: D67.1(+) JP28.2
N$563: D61.2(-) IC60.2(A:OUT) JP27.1 Q41.1(G) R261.2
N$564: IC65.1(A:OUT) R270.2
N$565: C60.1 R270.1 R271.1
N$566: IC65.5(B:+IN) R271.2 R272.2
N$567: IC65.6(B:-IN) R273.1 R274.2
N$568: D68.1(+) JP29.1
N$569: JP27.3 R259.1 R260.1
N$570: IC60.13(D:OUT)
N$571: R251.1 X16.21
N$572: Q40.2(C) R251.2 R275.1
VCC: 6V5.TP(PP) C53.1 IC57.OUT IC60.3(P:V+) IC61.1(OUT) IC65.8(P:V+) R240.2 R243.2 R246.1 R253.2 R273.2 ; also sheet 1,2,3,4,5,7,8,9,10,11,12
Unconnected: IC56.4(Q7) IC56.5(Q9) IC56.7(Q6) IC56.9(Q8) IC62.7(DIS) IC63.2(A:T2) IC63.6(A:Q) IC63.7(A:!Q) IC63.10(B:Q) X16.20 X16.24

### Notes on the sheet
- Externe Beschaltung
- Variante "eine LED leuchtet"
- Variante "alle LEDs bis und
   mit Gang X leuchten"
- Anzeige:
- Klemmleisten
  Ausgang:
- Gang 1
- DauerPlus
  Konstant-Strom für LEDs
  Gang 1
  Gang 2
  Gang 3
  Gang 4
  Gang 5
  Neutrallampe
  Blinker rechts
  Blinker zusammen
  Blinker links
  Masse
- Gang 1
- Gang 2
- Gang 2
- Gang 3
- Gang 3
- Gang 1 | Gang 2 | Gang 3 | Gang 4 | Gang 5
- Gang 4
- Gang 4 | Klemmleisten Ausgang:
- Gang 5
- Gang 5
- Zündugsplus
  Choke
  Öldrucklampe
  Temperaturlampe
  Ladekontrolllampe
  Tankgeber (100hm)
  ABS-Lampe
  Lampentest
  Warnlampe
  Fernlichtlampe
  Geschwindigkeitssignal
  Menütaster
- Stromquelle für Gang
  LEDs. Für mehr als 12mA
  muss ein Widerstand "R_user"
  eingelötet werden. Für weniger
  muss der 1kOhm SMD Widerstand
  neben R_user entfernt werden
  I = 12V/1kOhm(default)+12V/R_user
  I= 12mA (default) + 12V/R_user
  Beispiel:
  R_user      Strom in LEDs
  1 kOhm     22-26mA
  ohne       11-13mA
- Externe Beschaltung
- an Zündungsplus anhängen
  (Neutral leuchtet wenn Gang 0
  eingelegt und Zündschlüssel steckt )
- Neutrallampe
  für eigene
  Ganganzeige
- DauerPlus Batterie 12V (rot weiss)
  Ganganzeige Signal C (gelb weiss)
  Ganganzeige Signal B (gelb schwarz)
  Ganganzeige Signal A (gelb dunkelblau)
  12V/350mA zum Starknopf (schwarz grün)
  Zündungsplus 12V (grün schwarz)
  Reservelampe (weiss)
  ABS Leuchte (blau)
  Ladekontrollleuchte (schaltet auf Masse) (violett schwarz)
  Temperaturleuchte (schaltet auf Masse) (braun schwarz)
  Öldruckleuchte (schaltet auf Masse) (braun grün)
  Chokelampe (schaltet auf Masse) (violett weiss)
- BL resistors
- 1k
- an Ausgang "Neutrallampe" anhängen
- Masse (braun)
  Lampentest (schaltet auf Masse)(weiss blau)
  Fernlichtlampe (12V) (weiss)
  Drehzahl Zündspule (schwarz blau)
  Blinker rechts (blau scharz)
  Masse (braun)
  Blinker links (blau rot)
  nicht angeschlossen
  Tachosiganl zum Blinrelais (balu grün)
  Tachogeber (gelb)
  Masse Tachobeger (braun)
  Tachobeleuchtung (12V Zündungsplus) (grau blau)
- RES | BAR
- 4.7V | rising edge trigger A
- ZündungsPlus
- current source 96mA
- 6V regulated for Opamps
- nicht bestückt

## Sheet 7 of 12
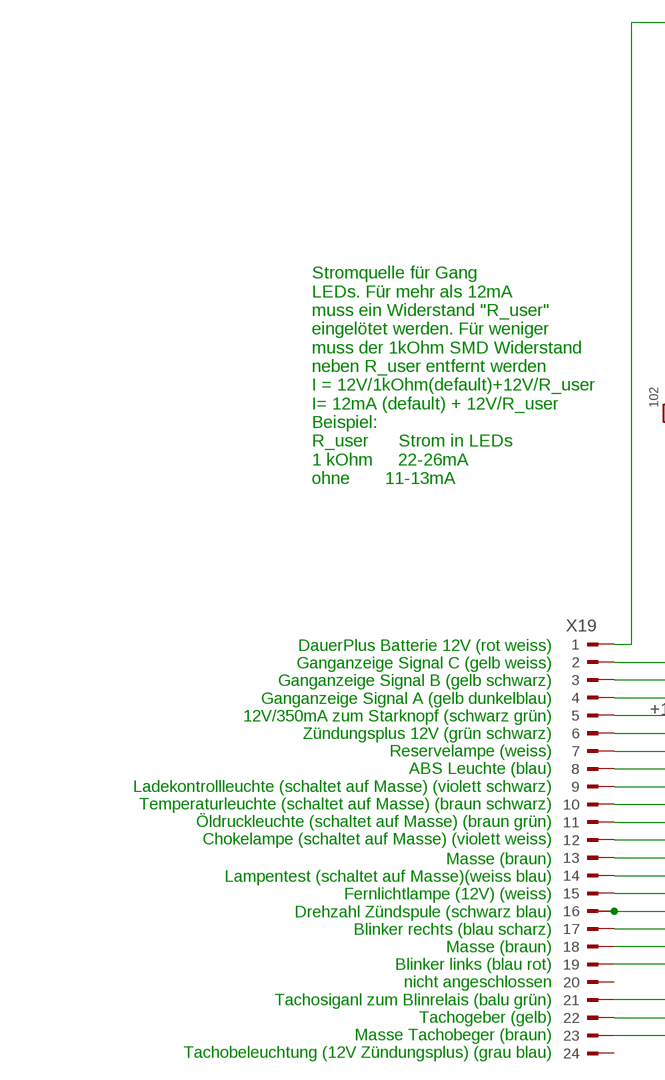
[diagram p12: schematic, sheet 7, part 1 of 2]
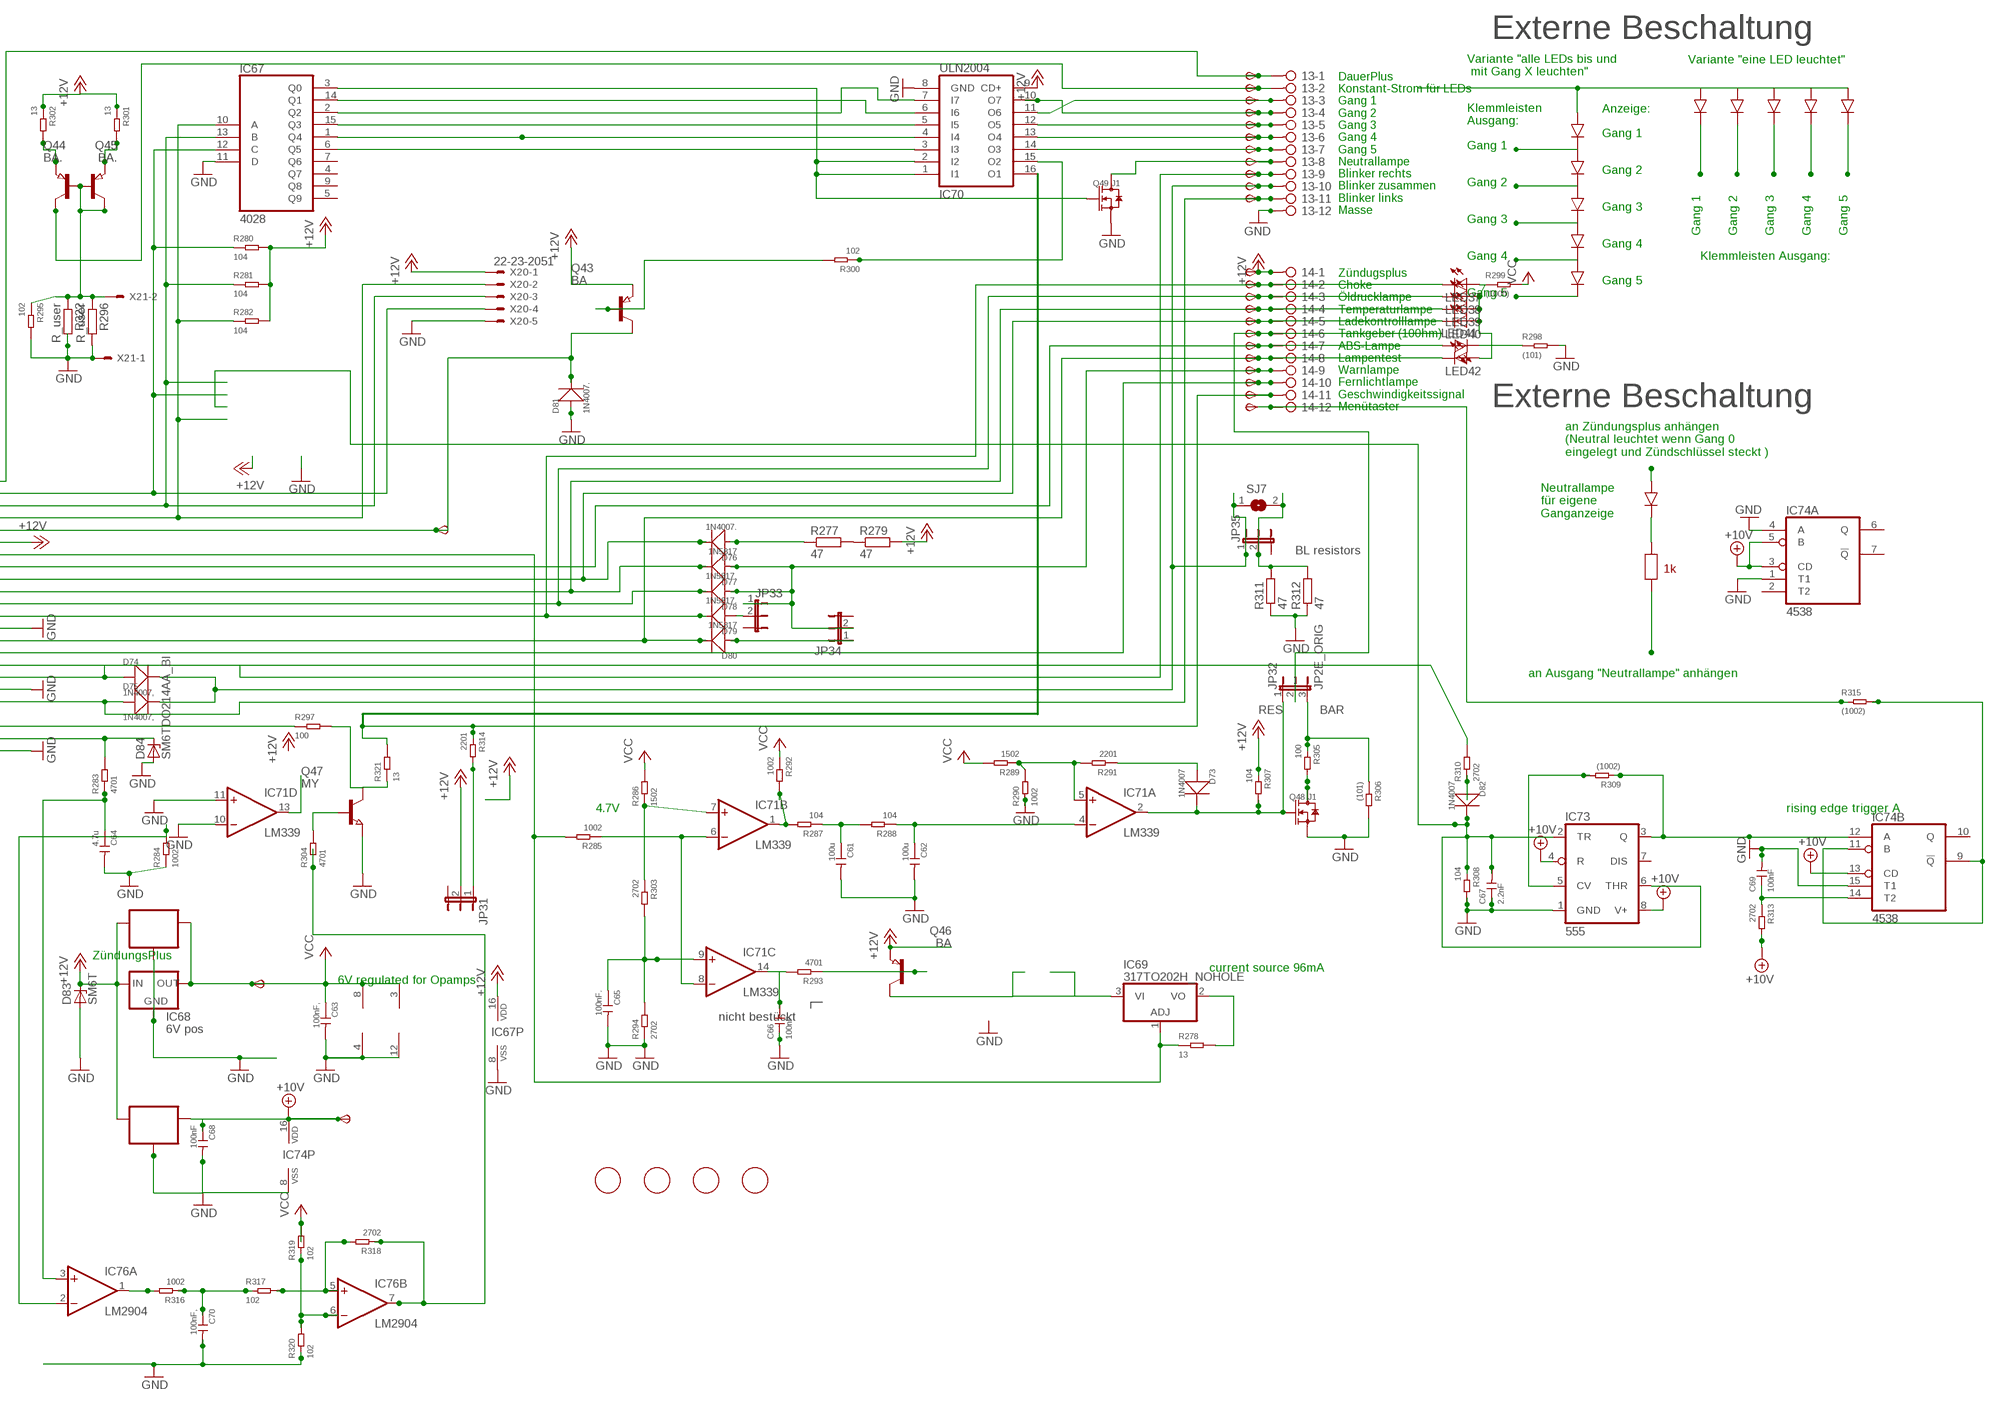
[diagram p13: schematic, sheet 7, part 2 of 2]

### Parts
6V6  TPSB2.0  [B2.0]
10V6  TPSB2.0  [B2.0]
13  2081-1132  [12-PIN]
14  2081-1132  [12-PIN]
C61  100u  CERAMIC-100UF-6.3V-20%-X5R(1206)  [C1206]
C62  100u  CERAMIC-100UF-6.3V-20%-X5R(1206)  [C1206]
C63  100nF,  CERAMIC-100NF-50V-10%-X7R(0805)  [C0805]
C64  4.7u  CERAMIC-4.7UF-25V-10%-X5R(0805)  [C0805]
C65  100nF.  CERAMIC-100NF-50V-10%-X7R(0805)  [C0805]
C66  100nF.  CERAMIC-100NF-50V-10%-X7R(0805)  [C0805]
C67  2.2nF  CERAMIC-100NF-50V-10%-X7R(0805)  [C0805]
C68  100nF  CERAMIC-100NF-50V-10%-X7R(0805)  [C0805]
C69  100nF  CERAMIC-100NF-50V-10%-X7R(0805)  [C0805]
C70  100nF,  CERAMIC-100NF-50V-10%-X7R(0805)  [C0805]
D73  1N4007  DIODE-GEN-PURPOSE-1KV-1A(DO-214AC)  [DO-214AC]
D74  1N4007,  DIODE-GEN-PURPOSE-1KV-1A(DO-214AC)  [DO-214AC]
D75  1N4007,  DIODE-GEN-PURPOSE-1KV-1A(DO-214AC)  [DO-214AC]
D76  1N4007.  DIODE-GEN-PURPOSE-1KV-1A(DO-214AC)  [DO-214AC]
D77  1N5817  DIODE-GEN-PURPOSE-1KV-1A(DO-214AC)DO-214AC/1206  [DO-214AC_SLIM]
D78  1N5817.  DIODE-GEN-PURPOSE-1KV-1A(DO-214AC)DO-214AC/1206  [DO-214AC_SLIM]
D79  1N5817.  DIODE-GEN-PURPOSE-1KV-1A(DO-214AC)DO-214AC/1206  [DO-214AC_SLIM]
D80  1N5817  DIODE-GEN-PURPOSE-1KV-1A(DO-214AC)DO-214AC/1206  [DO-214AC_SLIM]
D81  1N4007.  DIODE-GEN-PURPOSE-1KV-1A(DO-214AC)  [DO-214AC]
D82  1N4007  DIODE-GEN-PURPOSE-1KV-1A(DO-214AC)  [DO-214AC]
D83  SM6T  [DO214AA]
D84  SM6TDO214AA_BI  [DO214AA_BI]
FID25  FIDUCIAL  [FIDUCIAL_1MM]
FID26  FIDUCIAL  [FIDUCIAL_1MM]
FID27  FIDUCIAL  [FIDUCIAL_1MM]
FID28  FIDUCIAL  [FIDUCIAL_1MM]
IC67  4028  4028D  [SO16]
IC68  6V pos  78LXX  [78LXX]
IC69  317TO202H_NOHOLE  [TO220H_NOHOLE]
IC70  ULN2004  ULN2004AD  [SO16]
IC71  LM339  LM339D  [SO14]
IC72  78L06  78LXXSOT89_ROUND  [SOT89_ROUND]
IC73  555  NE555D  [SO08]
IC74  4538  4538D  [SO16]
IC75  78L10  78LXXSOT89_ROUND  [SOT89_ROUND]
IC76  LM2904  LM358D  [SO08]
JP31  JP2EJP2_SMALLPADS  [JP2_SMALLPADS]
JP32  JP2E_ORIG  [JP2_ORIG_SMALLPADS]
JP33  JP2EJP2_SMALLPADS  [JP2_SMALLPADS]
JP34  JP2EJP2_SMALLPADS  [JP2_SMALLPADS]
JP35  JP2EJP2_SMALLPADS  [JP2_SMALLPADS]
LED37  LEDLD260  [LD260]
LED38  LEDLD260  [LD260]
LED39  LEDLD260  [LD260]
LED40  LEDLD260  [LD260]
LED41  LEDLD260  [LD260]
LED42  LEDLD260  [LD260]
Q43  BA  PNP-TRANSISTOR_SOT89  [SOT89]
Q44  BA.  PNP-TRANSISTOR_SOT89  [SOT89]
Q45  BA.  PNP-TRANSISTOR_SOT89  [SOT89]
Q46  BA  PNP-TRANSISTOR_SOT89  [SOT89]
Q47  MY  NPN-TRANSISTOR_SOT89  [SOT89]
Q48  J1  SMD-MOSFET-N-CH-50V-200MA-BSS138W-7-F(SOT-23)  [SOT-23]
Q49  J1  SMD-MOSFET-N-CH-50V-200MA-BSS138W-7-F(SOT-23)  [SOT-23]
R277  47  R-EU_V235/17_1MM  [V235/17_1MM]
R278  13  SMD-RES-13R-5%-1/4W(1206)  [R1206]
R279  47  R-EU_V235/17_1MM  [V235/17_1MM]
R280  104  SMD-RES-10K-1%-1/8W(0805)  [R0805]
R281  104  SMD-RES-10K-1%-1/8W(0805)  [R0805]
R282  104  SMD-RES-10K-1%-1/8W(0805)  [R0805]
R283  4701  SMD-RES-4.7K-5%-1/8W(0805)  [R0805]
R284  1002  SMD-RES-10K-1%-1/8W(0805)  [R0805]
R285  1002  SMD-RES-10K-1%-1/8W(0805)  [R0805]
R286  1502  SMD-RES-10K-1%-1/8W(0805)  [R0805]
R287  104  SMD-RES-10K-1%-1/8W(0805)  [R0805]
R288  104  SMD-RES-10K-1%-1/8W(0805)  [R0805]
R289  1502  SMD-RES-10K-1%-1/8W(0805)  [R0805]
R290  1002  SMD-RES-10K-1%-1/8W(0805)  [R0805]
R291  2201  SMD-RES-2.2K-5%-1/8W(0805)  [R0805]
R292  1002  SMD-RES-10K-1%-1/8W(0805)  [R0805]
R293  4701  SMD-RES-4.7K-5%-1/8W(0805)  [R0805]
R294  2702  SMD-RES-4.7K-5%-1/8W(0805)  [R0805]
R295  102  SMD-RES-1K-5%-1/8W(0805)  [R0805]
R296  R_user  R-EU_R0805  [R0805]
R297  100  SMD-RES-220R-5%-1/8W(0805)  [R0805]
R298  (101)  SMD-RES-100R-5%-1/8W(0805)  [R0805]
R299  (1000)  SMD-RES-100R-5%-1/8W(0805)  [R0805]
R300  102  SMD-RES-1K-5%-1/8W(0805)  [R0805]
R301  13  SMD-RES-13R-5%-1/4W(1206)  [R1206]
R302  13  SMD-RES-13R-5%-1/4W(1206)  [R1206]
R303  2702  SMD-RES-4.7K-5%-1/8W(0805)  [R0805]
R304  4701  SMD-RES-4.7K-5%-1/8W(0805)  [R0805]
R305  100  SMD-RES-2.2K-5%-1/8W(0805)  [R0805]
R306  (101)  SMD-RES-2.2K-5%-1/8W(0805)  [R0805]
R307  104  SMD-RES-10K-1%-1/8W(0805)  [R0805]
R308  104  SMD-RES-10K-1%-1/8W(0805)  [R0805]
R309  (1002)  SMD-RES-10K-1%-1/8W(0805)  [R0805]
R310  2702  SMD-RES-10K-1%-1/8W(0805)  [R0805]
R311  47  R-EU_V235/17_1MM  [V235/17_1MM]
R312  47  R-EU_V235/17_1MM  [V235/17_1MM]
R313  2702  SMD-RES-4.7K-5%-1/8W(0805)  [R0805]
R314  2201  SMD-RES-2.2K-5%-1/8W(0805)  [R0805]
R315  (1002)  SMD-RES-4.7K-5%-1/8W(0805)  [R0805]
R316  1002  SMD-RES-10K-1%-1/8W(0805)  [R0805]
R317  102  SMD-RES-1K-5%-1/8W(0805)  [R0805]
R318  2702  SMD-RES-4.7K-5%-1/8W(0805)  [R0805]
R319  102  SMD-RES-1K-5%-1/8W(0805)  [R0805]
R320  102  SMD-RES-1K-5%-1/8W(0805)  [R0805]
R321  13  SMD-RES-13R-5%-1/4W(1206)  [R1206]
R322  R_user  R-EU_R0805  [R0805]
SJ7  SJ  [SJ]
START6  TPSB2.0  [B2.0]
TP139  TPSB2.0  [B2.0]
TP140  TPSB2.0  [B2.0]
TP141  TPSB2.0  [B2.0]
TP142  TPSB2.0  [B2.0]
TP143  TPSB2.0  [B2.0]
TP144  TPSB2.0  [B2.0]
TP145  TPSB2.0  [B2.0]
TP146  TPSB2.0  [B2.0]
TP147  TPSB2.0  [B2.0]
TP148  TPSB2.0  [B2.0]
TP149  TPSB2.0  [B2.0]
TP150  TPSB2.0  [B2.0]
TP151  TPSB2.0  [B2.0]
TP152  TPSB2.0  [B2.0]
TP153  TPSB2.0  [B2.0]
TP154  TPSB2.0  [B2.0]
TP155  TPSB2.0  [B2.0]
TP156  TPSB2.0  [B2.0]
TP157  TPSB1,27  [B1,27]
TP158  TPSB2.0  [B2.0]
TP159  TPSB2.0  [B2.0]
TP160  TPSB2.0  [B2.0]
TP161  TPSB2.0  [B2.0]
X19  CON_BMWV2  [24-PIN_V2]
X20  22-23-2051  [22-23-2051]
X21  22-23-2021  [22-23-2021]

### Nets
+10V: 10V6.TP(PP) C68.1 IC73.4(R) IC73.8(V+) IC74.3(A:CD) IC74.5(A:B) IC74.13(B:CD) IC74.16(P:VDD) IC75.1(OUT) R313.2 ; also sheet 1,2,3,4,5,6,8,9,10,11,12
+12V: 14.1 D83.C IC67.16(VDD) IC68.IN IC70.9(CD+) IC72.3(IN) IC75.3(IN) JP31.2 Q43.3(E) Q46.3(E) R279.2 R280.2 R281.2 R282.2 R301.1 R302.1 R307.1 TP160.TP(PP) X19.6 X20.1 ; also sheet 1,2,3,4,5,6,8,9,10,11,12
+12V7: IC76.7(B:OUT) R304.1 R318.1
GND: 13.12 C61.2 C62.2 C63.2 C64.2 C65.2 C66.1 C67.1 C68.2 C69.2 C70.2 D81.1(+) D83.A D84.A IC67.8(VSS) IC67.11(D) IC68.GND IC70.8(GND) IC71.10(D:-IN) IC71.11(D:+IN) IC71.12(P:GND) IC72.2(GND) IC72.2@1(GND) IC73.1(GND) IC74.1(A:T1) IC74.4(A:A) IC74.8(P:VSS) IC74.15(B:T1) IC75.2(GND) IC75.2@1(GND) IC76.4(P:V-) Q47.3(E) Q48.2(S) Q49.2(S) R284.1 R290.1 R294.1 R295.2 R296.2 R298.2 R306.2 R308.2 R311.1 R312.1 R320.1 R322.2 X19.13 X19.18 X19.23 X20.5 X21.1 ; also sheet 1,2,3,4,5,6,8,9,10,11,12
N$595: R277.2 R279.1
N$596: 14.9 D77.1(+) D78.1(+) JP33.1 JP34.2 TP157.TP(PP)
N$597: IC67.10(A) R282.1 X19.4 X20.2
N$598: IC67.13(B) R281.1 X19.3 X20.3
N$599: D81.2(-) Q43.2(C) START6.TP(PP) X19.5
N$600: IC67.12(C) R280.1 X19.2 X20.4
N$601: 14.7 LED41.A TP155.TP(PP) X19.8
N$602: 14.2 D79.2(-) LED37.K(C) TP150.TP(PP) X19.12
N$603: 14.3 D78.2(-) LED38.K(C) TP151.TP(PP) X19.11
N$604: 14.4 D77.2(-) LED39.K(C) TP152.TP(PP) X19.10
N$605: 14.8 D80.2(-) LED42.K(C) TP156.TP(PP) X19.14
N$606: 13.9 D74.1(+) TP147.TP(PP) X19.17
N$607: 13.11 D75.1(+) TP149.TP(PP) X19.19
N$608: D84.C R283.2 X19.22
N$609: C64.1 IC76.3(A:+IN) R283.1
N$610: 14.11 IC70.16(O1) R314.1 R321.2 TP159.TP(PP)
N$611: IC71.1(B:OUT) R287.2 R292.2
N$612: C61.1 R287.1 R288.2
N$613: C62.1 IC71.4(A:-IN) R288.1
N$614: IC71.5(A:+IN) R289.1 R290.2 R291.2
N$615: D73.1(+) R291.1
N$616: C65.1 IC71.9(C:+IN) R294.2 R303.2
N$617: C66.2 IC71.14(C:OUT) R293.2
N$618: Q46.1(B) R293.1
N$619: IC67.2(Q2) IC70.7(I7)
N$620: 13.5 IC70.12(O5) TP143.TP(PP)
N$621: IC67.1(Q4) IC70.4(I4)
N$622: 13.8 Q49.3(D) TP146.TP(PP)
N$623: 14.10 TP158.TP(PP) X19.15
N$624: 14.5 D76.2(-) LED40.K(C) TP153.TP(PP) X19.9
N$625: D76.1(+) R277.1
N$626: IC67.6(Q5) IC70.3(I3)
N$627: 13.4 IC70.10(O7) TP142.TP(PP)
N$628: IC69.1(ADJ) R278.1 R285.2 X19.7
N$629: IC71.6(B:-IN) IC71.8(C:-IN) R285.1
N$630: 13.2 Q45.2(C) TP140.TP(PP)
N$631: 13.1 TP139.TP(PP) X19.1
N$645: R310.2 X19.16
N$646: IC67.15(Q3) IC70.5(I5)
N$647: 13.6 IC70.13(O4) TP144.TP(PP)
N$648: 13.7 IC70.14(O3) TP145.TP(PP)
N$649: 14.6 JP32.2 TP154.TP(PP)
N$650: LED41.K(C) R298.1
N$651: LED37.A LED38.A LED39.A LED40.A LED42.A R299.1
N$652: Q43.1(B) R300.2
N$653: IC67.3(Q0) IC70.1(I1) IC70.2(I2) Q49.1(G)
N$654: IC67.14(Q1) IC70.6(I6)
N$655: 13.3 IC70.11(O6) TP141.TP(PP)
N$656: Q44.1(B) Q44.2(C) Q45.1(B) R295.1 R296.1 R322.1 X21.2
N$657: Q45.3(E) R302.2
N$658: Q44.3(E) R301.2
N$659: IC71.7(B:+IN) R286.1 R303.1
N$660: IC76.2(A:-IN) R284.2
N$661: Q47.1(B) R304.2
N$662: Q48.3(D) R305.2
N$663: IC69.2(VO) R278.2
N$664: IC69.3(VI) Q46.2(C)
N$665: C67.2 D82.2(-) IC73.2(TR) IC73.6(THR) R308.1
N$666: IC73.5(CV) R309.2
N$667: IC73.3(Q) IC74.12(B:A) R309.1
N$668: D82.1(+) R310.1
N$669: 13.10 D74.2(-) D75.2(-) JP35.1 SJ7.1 TP148.TP(PP)
N$670: JP35.2 R311.2 R312.2 SJ7.2
N$671: IC74.9(B:!Q) IC74.11(B:B) R315.2
N$672: C69.1 IC74.14(B:T2) R313.1
N$673: JP31.1 R314.2
N$674: IC70.15(O2) R300.1
N$675: 14.12 R315.1 TP161.TP(PP)
N$676: D79.1(+) JP33.2
N$677: D73.2(-) IC71.2(A:OUT) JP32.1 Q48.1(G) R307.2
N$678: IC76.1(A:OUT) R316.2
N$679: C70.1 R316.1 R317.1
N$680: IC76.5(B:+IN) R317.2 R318.2
N$681: IC76.6(B:-IN) R319.1 R320.2
N$682: D80.1(+) JP34.1
N$683: JP32.3 R305.1 R306.1
N$684: IC71.13(D:OUT)
N$685: R297.1 X19.21
N$686: Q47.2(C) R297.2 R321.1
VCC: 6V6.TP(PP) C63.1 IC68.OUT IC71.3(P:V+) IC72.1(OUT) IC76.8(P:V+) R286.2 R289.2 R292.1 R299.2 R319.2 ; also sheet 1,2,3,4,5,6,8,9,10,11,12
Unconnected: IC67.4(Q7) IC67.5(Q9) IC67.7(Q6) IC67.9(Q8) IC73.7(DIS) IC74.2(A:T2) IC74.6(A:Q) IC74.7(A:!Q) IC74.10(B:Q) X19.20 X19.24

### Notes on the sheet
- Externe Beschaltung
- Variante "eine LED leuchtet"
- Variante "alle LEDs bis und
   mit Gang X leuchten"
- Anzeige:
- Klemmleisten
  Ausgang:
- Gang 1
- DauerPlus
  Konstant-Strom für LEDs
  Gang 1
  Gang 2
  Gang 3
  Gang 4
  Gang 5
  Neutrallampe
  Blinker rechts
  Blinker zusammen
  Blinker links
  Masse
- Gang 1
- Gang 2
- Gang 2
- Gang 3
- Gang 3
- Gang 1 | Gang 2 | Gang 3 | Gang 4 | Gang 5
- Gang 4
- Gang 4 | Klemmleisten Ausgang:
- Gang 5
- Gang 5
- Zündugsplus
  Choke
  Öldrucklampe
  Temperaturlampe
  Ladekontrolllampe
  Tankgeber (100hm)
  ABS-Lampe
  Lampentest
  Warnlampe
  Fernlichtlampe
  Geschwindigkeitssignal
  Menütaster
- Stromquelle für Gang
  LEDs. Für mehr als 12mA
  muss ein Widerstand "R_user"
  eingelötet werden. Für weniger
  muss der 1kOhm SMD Widerstand
  neben R_user entfernt werden
  I = 12V/1kOhm(default)+12V/R_user
  I= 12mA (default) + 12V/R_user
  Beispiel:
  R_user      Strom in LEDs
  1 kOhm     22-26mA
  ohne       11-13mA
- Externe Beschaltung
- an Zündungsplus anhängen
  (Neutral leuchtet wenn Gang 0
  eingelegt und Zündschlüssel steckt )
- Neutrallampe
  für eigene
  Ganganzeige
- DauerPlus Batterie 12V (rot weiss)
  Ganganzeige Signal C (gelb weiss)
  Ganganzeige Signal B (gelb schwarz)
  Ganganzeige Signal A (gelb dunkelblau)
  12V/350mA zum Starknopf (schwarz grün)
  Zündungsplus 12V (grün schwarz)
  Reservelampe (weiss)
  ABS Leuchte (blau)
  Ladekontrollleuchte (schaltet auf Masse) (violett schwarz)
  Temperaturleuchte (schaltet auf Masse) (braun schwarz)
  Öldruckleuchte (schaltet auf Masse) (braun grün)
  Chokelampe (schaltet auf Masse) (violett weiss)
- BL resistors
- 1k
- an Ausgang "Neutrallampe" anhängen
- Masse (braun)
  Lampentest (schaltet auf Masse)(weiss blau)
  Fernlichtlampe (12V) (weiss)
  Drehzahl Zündspule (schwarz blau)
  Blinker rechts (blau scharz)
  Masse (braun)
  Blinker links (blau rot)
  nicht angeschlossen
  Tachosiganl zum Blinrelais (balu grün)
  Tachogeber (gelb)
  Masse Tachobeger (braun)
  Tachobeleuchtung (12V Zündungsplus) (grau blau)
- RES | BAR
- 4.7V | rising edge trigger A
- ZündungsPlus
- current source 96mA
- 6V regulated for Opamps
- nicht bestückt

## Sheet 8 of 12
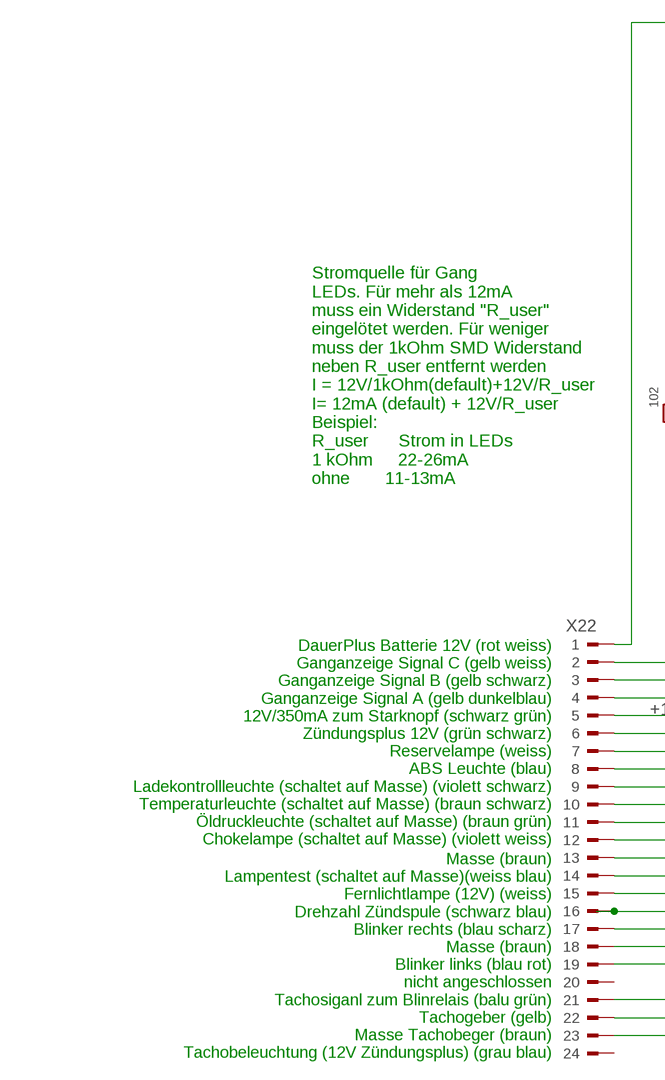
[diagram p14: schematic, sheet 8, part 1 of 2]
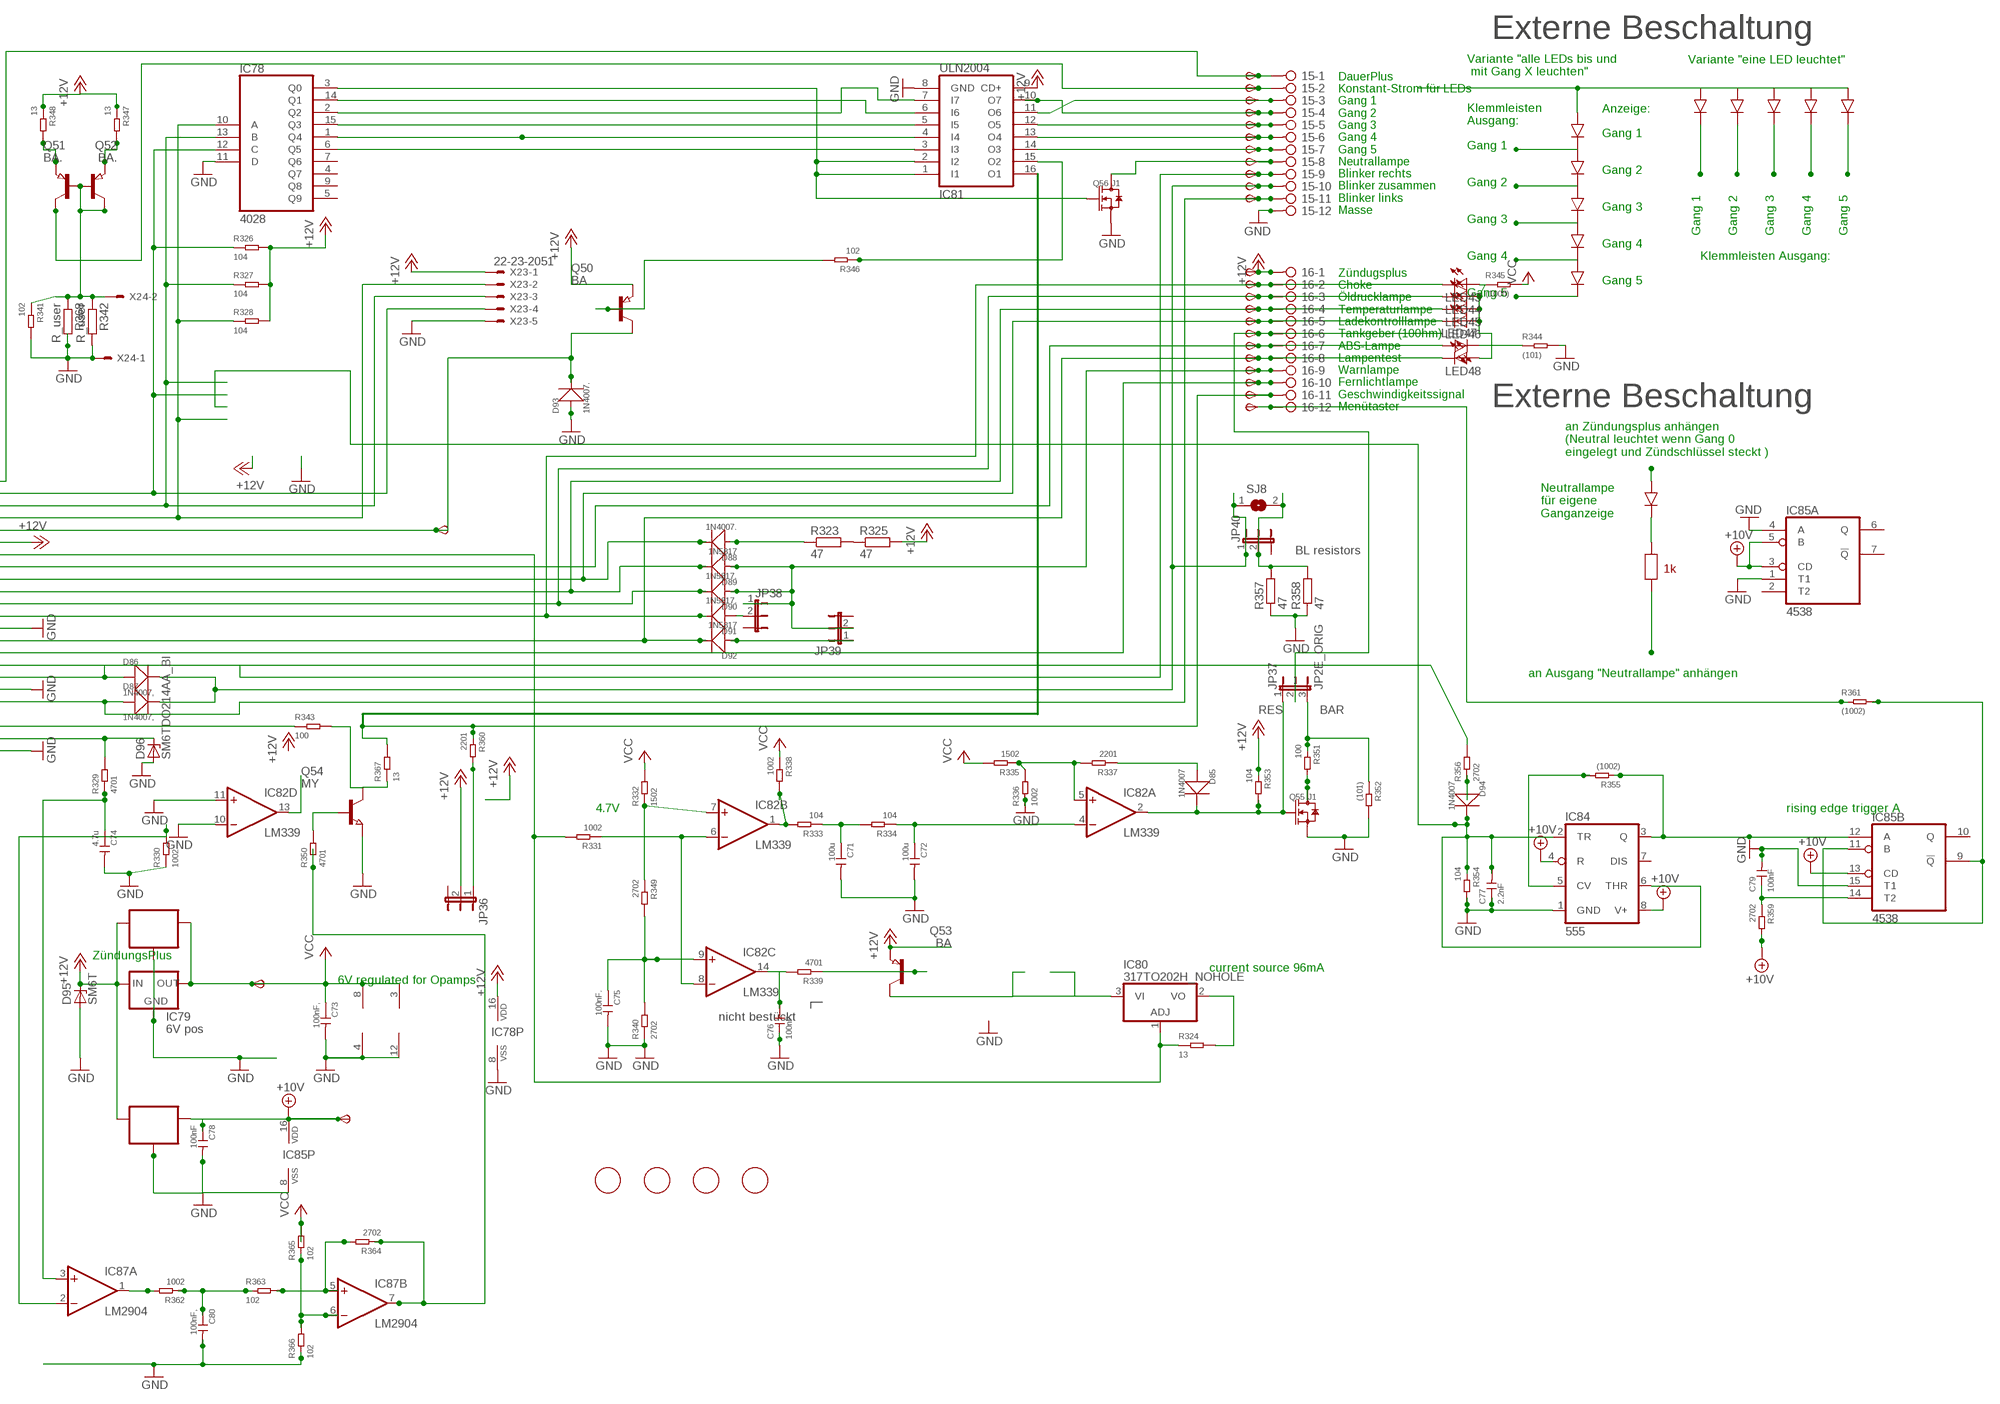
[diagram p15: schematic, sheet 8, part 2 of 2]

### Parts
6V7  TPSB2.0  [B2.0]
10V7  TPSB2.0  [B2.0]
15  2081-1132  [12-PIN]
16  2081-1132  [12-PIN]
C71  100u  CERAMIC-100UF-6.3V-20%-X5R(1206)  [C1206]
C72  100u  CERAMIC-100UF-6.3V-20%-X5R(1206)  [C1206]
C73  100nF,  CERAMIC-100NF-50V-10%-X7R(0805)  [C0805]
C74  4.7u  CERAMIC-4.7UF-25V-10%-X5R(0805)  [C0805]
C75  100nF.  CERAMIC-100NF-50V-10%-X7R(0805)  [C0805]
C76  100nF.  CERAMIC-100NF-50V-10%-X7R(0805)  [C0805]
C77  2.2nF  CERAMIC-100NF-50V-10%-X7R(0805)  [C0805]
C78  100nF  CERAMIC-100NF-50V-10%-X7R(0805)  [C0805]
C79  100nF  CERAMIC-100NF-50V-10%-X7R(0805)  [C0805]
C80  100nF,  CERAMIC-100NF-50V-10%-X7R(0805)  [C0805]
D85  1N4007  DIODE-GEN-PURPOSE-1KV-1A(DO-214AC)  [DO-214AC]
D86  1N4007,  DIODE-GEN-PURPOSE-1KV-1A(DO-214AC)  [DO-214AC]
D87  1N4007,  DIODE-GEN-PURPOSE-1KV-1A(DO-214AC)  [DO-214AC]
D88  1N4007.  DIODE-GEN-PURPOSE-1KV-1A(DO-214AC)  [DO-214AC]
D89  1N5817  DIODE-GEN-PURPOSE-1KV-1A(DO-214AC)DO-214AC/1206  [DO-214AC_SLIM]
D90  1N5817.  DIODE-GEN-PURPOSE-1KV-1A(DO-214AC)DO-214AC/1206  [DO-214AC_SLIM]
D91  1N5817.  DIODE-GEN-PURPOSE-1KV-1A(DO-214AC)DO-214AC/1206  [DO-214AC_SLIM]
D92  1N5817  DIODE-GEN-PURPOSE-1KV-1A(DO-214AC)DO-214AC/1206  [DO-214AC_SLIM]
D93  1N4007.  DIODE-GEN-PURPOSE-1KV-1A(DO-214AC)  [DO-214AC]
D94  1N4007  DIODE-GEN-PURPOSE-1KV-1A(DO-214AC)  [DO-214AC]
D95  SM6T  [DO214AA]
D96  SM6TDO214AA_BI  [DO214AA_BI]
FID29  FIDUCIAL  [FIDUCIAL_1MM]
FID30  FIDUCIAL  [FIDUCIAL_1MM]
FID31  FIDUCIAL  [FIDUCIAL_1MM]
FID32  FIDUCIAL  [FIDUCIAL_1MM]
IC78  4028  4028D  [SO16]
IC79  6V pos  78LXX  [78LXX]
IC80  317TO202H_NOHOLE  [TO220H_NOHOLE]
IC81  ULN2004  ULN2004AD  [SO16]
IC82  LM339  LM339D  [SO14]
IC83  78L06  78LXXSOT89_ROUND  [SOT89_ROUND]
IC84  555  NE555D  [SO08]
IC85  4538  4538D  [SO16]
IC86  78L10  78LXXSOT89_ROUND  [SOT89_ROUND]
IC87  LM2904  LM358D  [SO08]
JP36  JP2EJP2_SMALLPADS  [JP2_SMALLPADS]
JP37  JP2E_ORIG  [JP2_ORIG_SMALLPADS]
JP38  JP2EJP2_SMALLPADS  [JP2_SMALLPADS]
JP39  JP2EJP2_SMALLPADS  [JP2_SMALLPADS]
JP40  JP2EJP2_SMALLPADS  [JP2_SMALLPADS]
LED43  LEDLD260  [LD260]
LED44  LEDLD260  [LD260]
LED45  LEDLD260  [LD260]
LED46  LEDLD260  [LD260]
LED47  LEDLD260  [LD260]
LED48  LEDLD260  [LD260]
Q50  BA  PNP-TRANSISTOR_SOT89  [SOT89]
Q51  BA.  PNP-TRANSISTOR_SOT89  [SOT89]
Q52  BA.  PNP-TRANSISTOR_SOT89  [SOT89]
Q53  BA  PNP-TRANSISTOR_SOT89  [SOT89]
Q54  MY  NPN-TRANSISTOR_SOT89  [SOT89]
Q55  J1  SMD-MOSFET-N-CH-50V-200MA-BSS138W-7-F(SOT-23)  [SOT-23]
Q56  J1  SMD-MOSFET-N-CH-50V-200MA-BSS138W-7-F(SOT-23)  [SOT-23]
R323  47  R-EU_V235/17_1MM  [V235/17_1MM]
R324  13  SMD-RES-13R-5%-1/4W(1206)  [R1206]
R325  47  R-EU_V235/17_1MM  [V235/17_1MM]
R326  104  SMD-RES-10K-1%-1/8W(0805)  [R0805]
R327  104  SMD-RES-10K-1%-1/8W(0805)  [R0805]
R328  104  SMD-RES-10K-1%-1/8W(0805)  [R0805]
R329  4701  SMD-RES-4.7K-5%-1/8W(0805)  [R0805]
R330  1002  SMD-RES-10K-1%-1/8W(0805)  [R0805]
R331  1002  SMD-RES-10K-1%-1/8W(0805)  [R0805]
R332  1502  SMD-RES-10K-1%-1/8W(0805)  [R0805]
R333  104  SMD-RES-10K-1%-1/8W(0805)  [R0805]
R334  104  SMD-RES-10K-1%-1/8W(0805)  [R0805]
R335  1502  SMD-RES-10K-1%-1/8W(0805)  [R0805]
R336  1002  SMD-RES-10K-1%-1/8W(0805)  [R0805]
R337  2201  SMD-RES-2.2K-5%-1/8W(0805)  [R0805]
R338  1002  SMD-RES-10K-1%-1/8W(0805)  [R0805]
R339  4701  SMD-RES-4.7K-5%-1/8W(0805)  [R0805]
R340  2702  SMD-RES-4.7K-5%-1/8W(0805)  [R0805]
R341  102  SMD-RES-1K-5%-1/8W(0805)  [R0805]
R342  R_user  R-EU_R0805  [R0805]
R343  100  SMD-RES-220R-5%-1/8W(0805)  [R0805]
R344  (101)  SMD-RES-100R-5%-1/8W(0805)  [R0805]
R345  (1000)  SMD-RES-100R-5%-1/8W(0805)  [R0805]
R346  102  SMD-RES-1K-5%-1/8W(0805)  [R0805]
R347  13  SMD-RES-13R-5%-1/4W(1206)  [R1206]
R348  13  SMD-RES-13R-5%-1/4W(1206)  [R1206]
R349  2702  SMD-RES-4.7K-5%-1/8W(0805)  [R0805]
R350  4701  SMD-RES-4.7K-5%-1/8W(0805)  [R0805]
R351  100  SMD-RES-2.2K-5%-1/8W(0805)  [R0805]
R352  (101)  SMD-RES-2.2K-5%-1/8W(0805)  [R0805]
R353  104  SMD-RES-10K-1%-1/8W(0805)  [R0805]
R354  104  SMD-RES-10K-1%-1/8W(0805)  [R0805]
R355  (1002)  SMD-RES-10K-1%-1/8W(0805)  [R0805]
R356  2702  SMD-RES-10K-1%-1/8W(0805)  [R0805]
R357  47  R-EU_V235/17_1MM  [V235/17_1MM]
R358  47  R-EU_V235/17_1MM  [V235/17_1MM]
R359  2702  SMD-RES-4.7K-5%-1/8W(0805)  [R0805]
R360  2201  SMD-RES-2.2K-5%-1/8W(0805)  [R0805]
R361  (1002)  SMD-RES-4.7K-5%-1/8W(0805)  [R0805]
R362  1002  SMD-RES-10K-1%-1/8W(0805)  [R0805]
R363  102  SMD-RES-1K-5%-1/8W(0805)  [R0805]
R364  2702  SMD-RES-4.7K-5%-1/8W(0805)  [R0805]
R365  102  SMD-RES-1K-5%-1/8W(0805)  [R0805]
R366  102  SMD-RES-1K-5%-1/8W(0805)  [R0805]
R367  13  SMD-RES-13R-5%-1/4W(1206)  [R1206]
R368  R_user  R-EU_R0805  [R0805]
SJ8  SJ  [SJ]
START7  TPSB2.0  [B2.0]
TP162  TPSB2.0  [B2.0]
TP163  TPSB2.0  [B2.0]
TP164  TPSB2.0  [B2.0]
TP165  TPSB2.0  [B2.0]
TP166  TPSB2.0  [B2.0]
TP167  TPSB2.0  [B2.0]
TP168  TPSB2.0  [B2.0]
TP169  TPSB2.0  [B2.0]
TP170  TPSB2.0  [B2.0]
TP171  TPSB2.0  [B2.0]
TP172  TPSB2.0  [B2.0]
TP173  TPSB2.0  [B2.0]
TP174  TPSB2.0  [B2.0]
TP175  TPSB2.0  [B2.0]
TP176  TPSB2.0  [B2.0]
TP177  TPSB2.0  [B2.0]
TP178  TPSB2.0  [B2.0]
TP179  TPSB2.0  [B2.0]
TP180  TPSB1,27  [B1,27]
TP181  TPSB2.0  [B2.0]
TP182  TPSB2.0  [B2.0]
TP183  TPSB2.0  [B2.0]
TP184  TPSB2.0  [B2.0]
X22  CON_BMWV2  [24-PIN_V2]
X23  22-23-2051  [22-23-2051]
X24  22-23-2021  [22-23-2021]

### Nets
+10V: 10V7.TP(PP) C78.1 IC84.4(R) IC84.8(V+) IC85.3(A:CD) IC85.5(A:B) IC85.13(B:CD) IC85.16(P:VDD) IC86.1(OUT) R359.2 ; also sheet 1,2,3,4,5,6,7,9,10,11,12
+12V: 16.1 D95.C IC78.16(VDD) IC79.IN IC81.9(CD+) IC83.3(IN) IC86.3(IN) JP36.2 Q50.3(E) Q53.3(E) R325.2 R326.2 R327.2 R328.2 R347.1 R348.1 R353.1 TP183.TP(PP) X22.6 X23.1 ; also sheet 1,2,3,4,5,6,7,9,10,11,12
+12V8: IC87.7(B:OUT) R350.1 R364.1
GND: 15.12 C71.2 C72.2 C73.2 C74.2 C75.2 C76.1 C77.1 C78.2 C79.2 C80.2 D93.1(+) D95.A D96.A IC78.8(VSS) IC78.11(D) IC79.GND IC81.8(GND) IC82.10(D:-IN) IC82.11(D:+IN) IC82.12(P:GND) IC83.2(GND) IC83.2@1(GND) IC84.1(GND) IC85.1(A:T1) IC85.4(A:A) IC85.8(P:VSS) IC85.15(B:T1) IC86.2(GND) IC86.2@1(GND) IC87.4(P:V-) Q54.3(E) Q55.2(S) Q56.2(S) R330.1 R336.1 R340.1 R341.2 R342.2 R344.2 R352.2 R354.2 R357.1 R358.1 R366.1 R368.2 X22.13 X22.18 X22.23 X23.5 X24.1 ; also sheet 1,2,3,4,5,6,7,9,10,11,12
N$687: R323.2 R325.1
N$688: 16.9 D89.1(+) D90.1(+) JP38.1 JP39.2 TP180.TP(PP)
N$689: IC78.10(A) R328.1 X22.4 X23.2
N$690: IC78.13(B) R327.1 X22.3 X23.3
N$691: D93.2(-) Q50.2(C) START7.TP(PP) X22.5
N$692: IC78.12(C) R326.1 X22.2 X23.4
N$693: 16.7 LED47.A TP178.TP(PP) X22.8
N$694: 16.2 D91.2(-) LED43.K(C) TP173.TP(PP) X22.12
N$695: 16.3 D90.2(-) LED44.K(C) TP174.TP(PP) X22.11
N$696: 16.4 D89.2(-) LED45.K(C) TP175.TP(PP) X22.10
N$697: 16.8 D92.2(-) LED48.K(C) TP179.TP(PP) X22.14
N$698: 15.9 D86.1(+) TP170.TP(PP) X22.17
N$699: 15.11 D87.1(+) TP172.TP(PP) X22.19
N$700: D96.C R329.2 X22.22
N$701: C74.1 IC87.3(A:+IN) R329.1
N$702: 16.11 IC81.16(O1) R360.1 R367.2 TP182.TP(PP)
N$703: IC82.1(B:OUT) R333.2 R338.2
N$704: C71.1 R333.1 R334.2
N$705: C72.1 IC82.4(A:-IN) R334.1
N$706: IC82.5(A:+IN) R335.1 R336.2 R337.2
N$707: D85.1(+) R337.1
N$708: C75.1 IC82.9(C:+IN) R340.2 R349.2
N$709: C76.2 IC82.14(C:OUT) R339.2
N$710: Q53.1(B) R339.1
N$711: IC78.2(Q2) IC81.7(I7)
N$712: 15.5 IC81.12(O5) TP166.TP(PP)
N$713: IC78.1(Q4) IC81.4(I4)
N$714: 15.8 Q56.3(D) TP169.TP(PP)
N$715: 16.10 TP181.TP(PP) X22.15
N$716: 16.5 D88.2(-) LED46.K(C) TP176.TP(PP) X22.9
N$717: D88.1(+) R323.1
N$718: IC78.6(Q5) IC81.3(I3)
N$719: 15.4 IC81.10(O7) TP165.TP(PP)
N$720: IC80.1(ADJ) R324.1 R331.2 X22.7
N$721: IC82.6(B:-IN) IC82.8(C:-IN) R331.1
N$722: 15.2 Q52.2(C) TP163.TP(PP)
N$723: 15.1 TP162.TP(PP) X22.1
N$737: R356.2 X22.16
N$738: IC78.15(Q3) IC81.5(I5)
N$739: 15.6 IC81.13(O4) TP167.TP(PP)
N$740: 15.7 IC81.14(O3) TP168.TP(PP)
N$741: 16.6 JP37.2 TP177.TP(PP)
N$742: LED47.K(C) R344.1
N$743: LED43.A LED44.A LED45.A LED46.A LED48.A R345.1
N$744: Q50.1(B) R346.2
N$745: IC78.3(Q0) IC81.1(I1) IC81.2(I2) Q56.1(G)
N$746: IC78.14(Q1) IC81.6(I6)
N$747: 15.3 IC81.11(O6) TP164.TP(PP)
N$748: Q51.1(B) Q51.2(C) Q52.1(B) R341.1 R342.1 R368.1 X24.2
N$749: Q52.3(E) R348.2
N$750: Q51.3(E) R347.2
N$751: IC82.7(B:+IN) R332.1 R349.1
N$752: IC87.2(A:-IN) R330.2
N$753: Q54.1(B) R350.2
N$754: Q55.3(D) R351.2
N$755: IC80.2(VO) R324.2
N$756: IC80.3(VI) Q53.2(C)
N$757: C77.2 D94.2(-) IC84.2(TR) IC84.6(THR) R354.1
N$758: IC84.5(CV) R355.2
N$759: IC84.3(Q) IC85.12(B:A) R355.1
N$760: D94.1(+) R356.1
N$761: 15.10 D86.2(-) D87.2(-) JP40.1 SJ8.1 TP171.TP(PP)
N$762: JP40.2 R357.2 R358.2 SJ8.2
N$763: IC85.9(B:!Q) IC85.11(B:B) R361.2
N$764: C79.1 IC85.14(B:T2) R359.1
N$765: JP36.1 R360.2
N$766: IC81.15(O2) R346.1
N$767: 16.12 R361.1 TP184.TP(PP)
N$768: D91.1(+) JP38.2
N$769: D85.2(-) IC82.2(A:OUT) JP37.1 Q55.1(G) R353.2
N$770: IC87.1(A:OUT) R362.2
N$771: C80.1 R362.1 R363.1
N$772: IC87.5(B:+IN) R363.2 R364.2
N$773: IC87.6(B:-IN) R365.1 R366.2
N$774: D92.1(+) JP39.1
N$775: JP37.3 R351.1 R352.1
N$776: IC82.13(D:OUT)
N$777: R343.1 X22.21
N$778: Q54.2(C) R343.2 R367.1
VCC: 6V7.TP(PP) C73.1 IC79.OUT IC82.3(P:V+) IC83.1(OUT) IC87.8(P:V+) R332.2 R335.2 R338.1 R345.2 R365.2 ; also sheet 1,2,3,4,5,6,7,9,10,11,12
Unconnected: IC78.4(Q7) IC78.5(Q9) IC78.7(Q6) IC78.9(Q8) IC84.7(DIS) IC85.2(A:T2) IC85.6(A:Q) IC85.7(A:!Q) IC85.10(B:Q) X22.20 X22.24

### Notes on the sheet
- Externe Beschaltung
- Variante "eine LED leuchtet"
- Variante "alle LEDs bis und
   mit Gang X leuchten"
- Anzeige:
- Klemmleisten
  Ausgang:
- Gang 1
- DauerPlus
  Konstant-Strom für LEDs
  Gang 1
  Gang 2
  Gang 3
  Gang 4
  Gang 5
  Neutrallampe
  Blinker rechts
  Blinker zusammen
  Blinker links
  Masse
- Gang 1
- Gang 2
- Gang 2
- Gang 3
- Gang 3
- Gang 1 | Gang 2 | Gang 3 | Gang 4 | Gang 5
- Gang 4
- Gang 4 | Klemmleisten Ausgang:
- Gang 5
- Gang 5
- Zündugsplus
  Choke
  Öldrucklampe
  Temperaturlampe
  Ladekontrolllampe
  Tankgeber (100hm)
  ABS-Lampe
  Lampentest
  Warnlampe
  Fernlichtlampe
  Geschwindigkeitssignal
  Menütaster
- Stromquelle für Gang
  LEDs. Für mehr als 12mA
  muss ein Widerstand "R_user"
  eingelötet werden. Für weniger
  muss der 1kOhm SMD Widerstand
  neben R_user entfernt werden
  I = 12V/1kOhm(default)+12V/R_user
  I= 12mA (default) + 12V/R_user
  Beispiel:
  R_user      Strom in LEDs
  1 kOhm     22-26mA
  ohne       11-13mA
- Externe Beschaltung
- an Zündungsplus anhängen
  (Neutral leuchtet wenn Gang 0
  eingelegt und Zündschlüssel steckt )
- Neutrallampe
  für eigene
  Ganganzeige
- DauerPlus Batterie 12V (rot weiss)
  Ganganzeige Signal C (gelb weiss)
  Ganganzeige Signal B (gelb schwarz)
  Ganganzeige Signal A (gelb dunkelblau)
  12V/350mA zum Starknopf (schwarz grün)
  Zündungsplus 12V (grün schwarz)
  Reservelampe (weiss)
  ABS Leuchte (blau)
  Ladekontrollleuchte (schaltet auf Masse) (violett schwarz)
  Temperaturleuchte (schaltet auf Masse) (braun schwarz)
  Öldruckleuchte (schaltet auf Masse) (braun grün)
  Chokelampe (schaltet auf Masse) (violett weiss)
- BL resistors
- 1k
- an Ausgang "Neutrallampe" anhängen
- Masse (braun)
  Lampentest (schaltet auf Masse)(weiss blau)
  Fernlichtlampe (12V) (weiss)
  Drehzahl Zündspule (schwarz blau)
  Blinker rechts (blau scharz)
  Masse (braun)
  Blinker links (blau rot)
  nicht angeschlossen
  Tachosiganl zum Blinrelais (balu grün)
  Tachogeber (gelb)
  Masse Tachobeger (braun)
  Tachobeleuchtung (12V Zündungsplus) (grau blau)
- RES | BAR
- 4.7V | rising edge trigger A
- ZündungsPlus
- current source 96mA
- 6V regulated for Opamps
- nicht bestückt